# EAGLE schematic backplanev2-final (EAGLE 6.4)
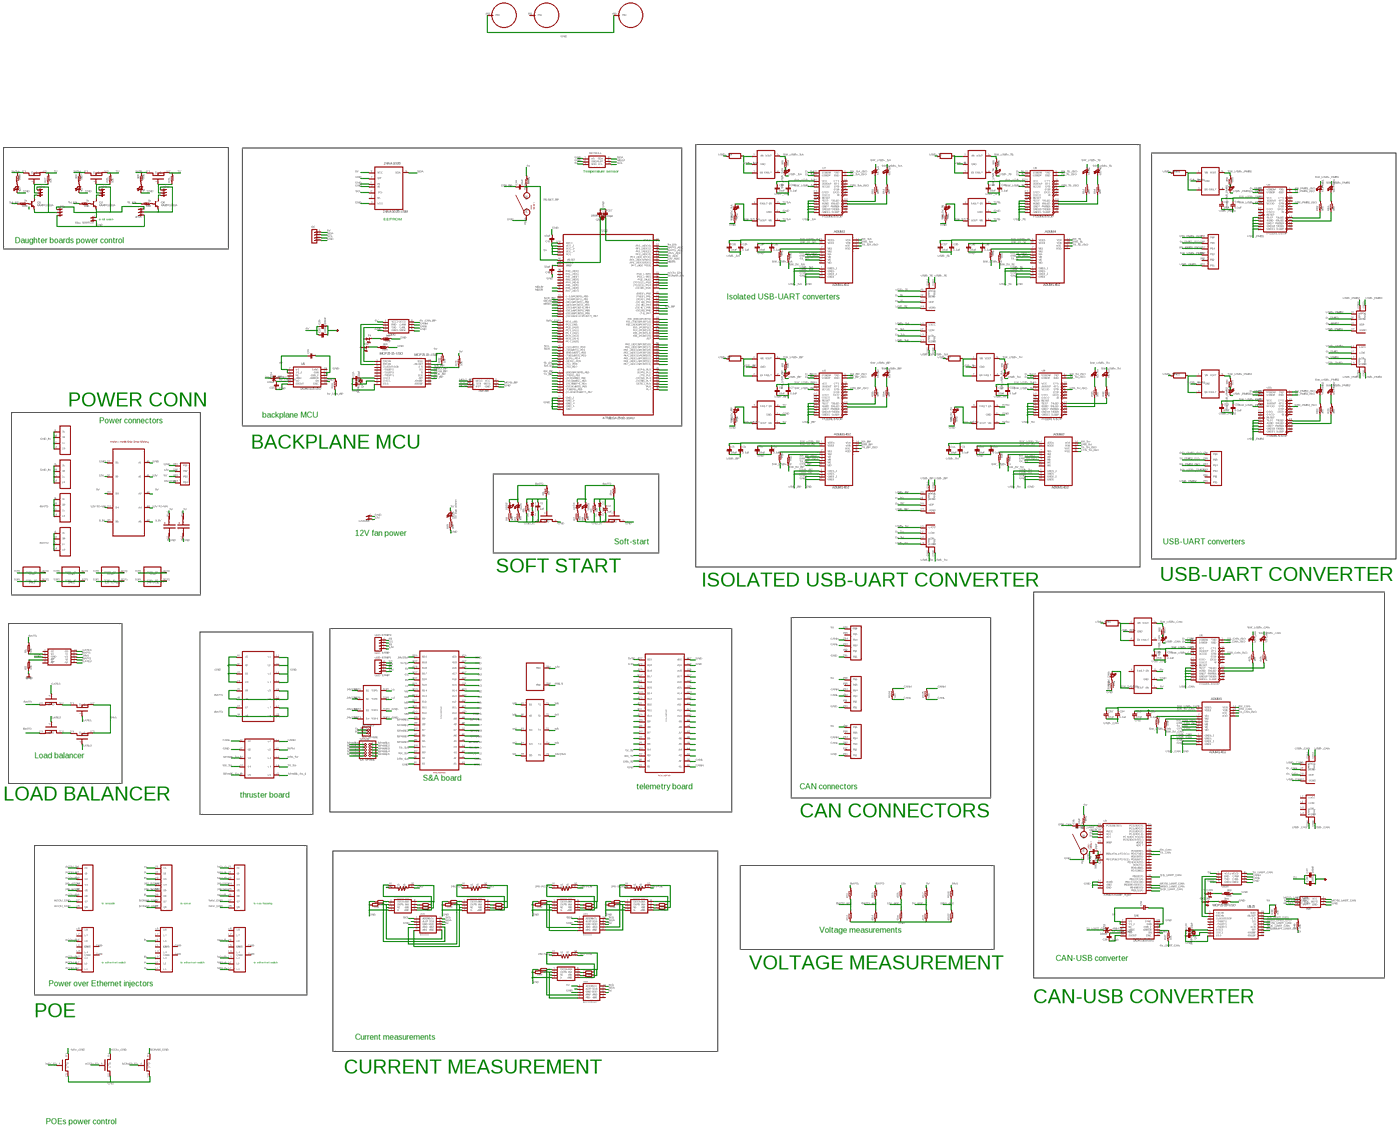
[diagram p0: schematic, sheet 1, overview]
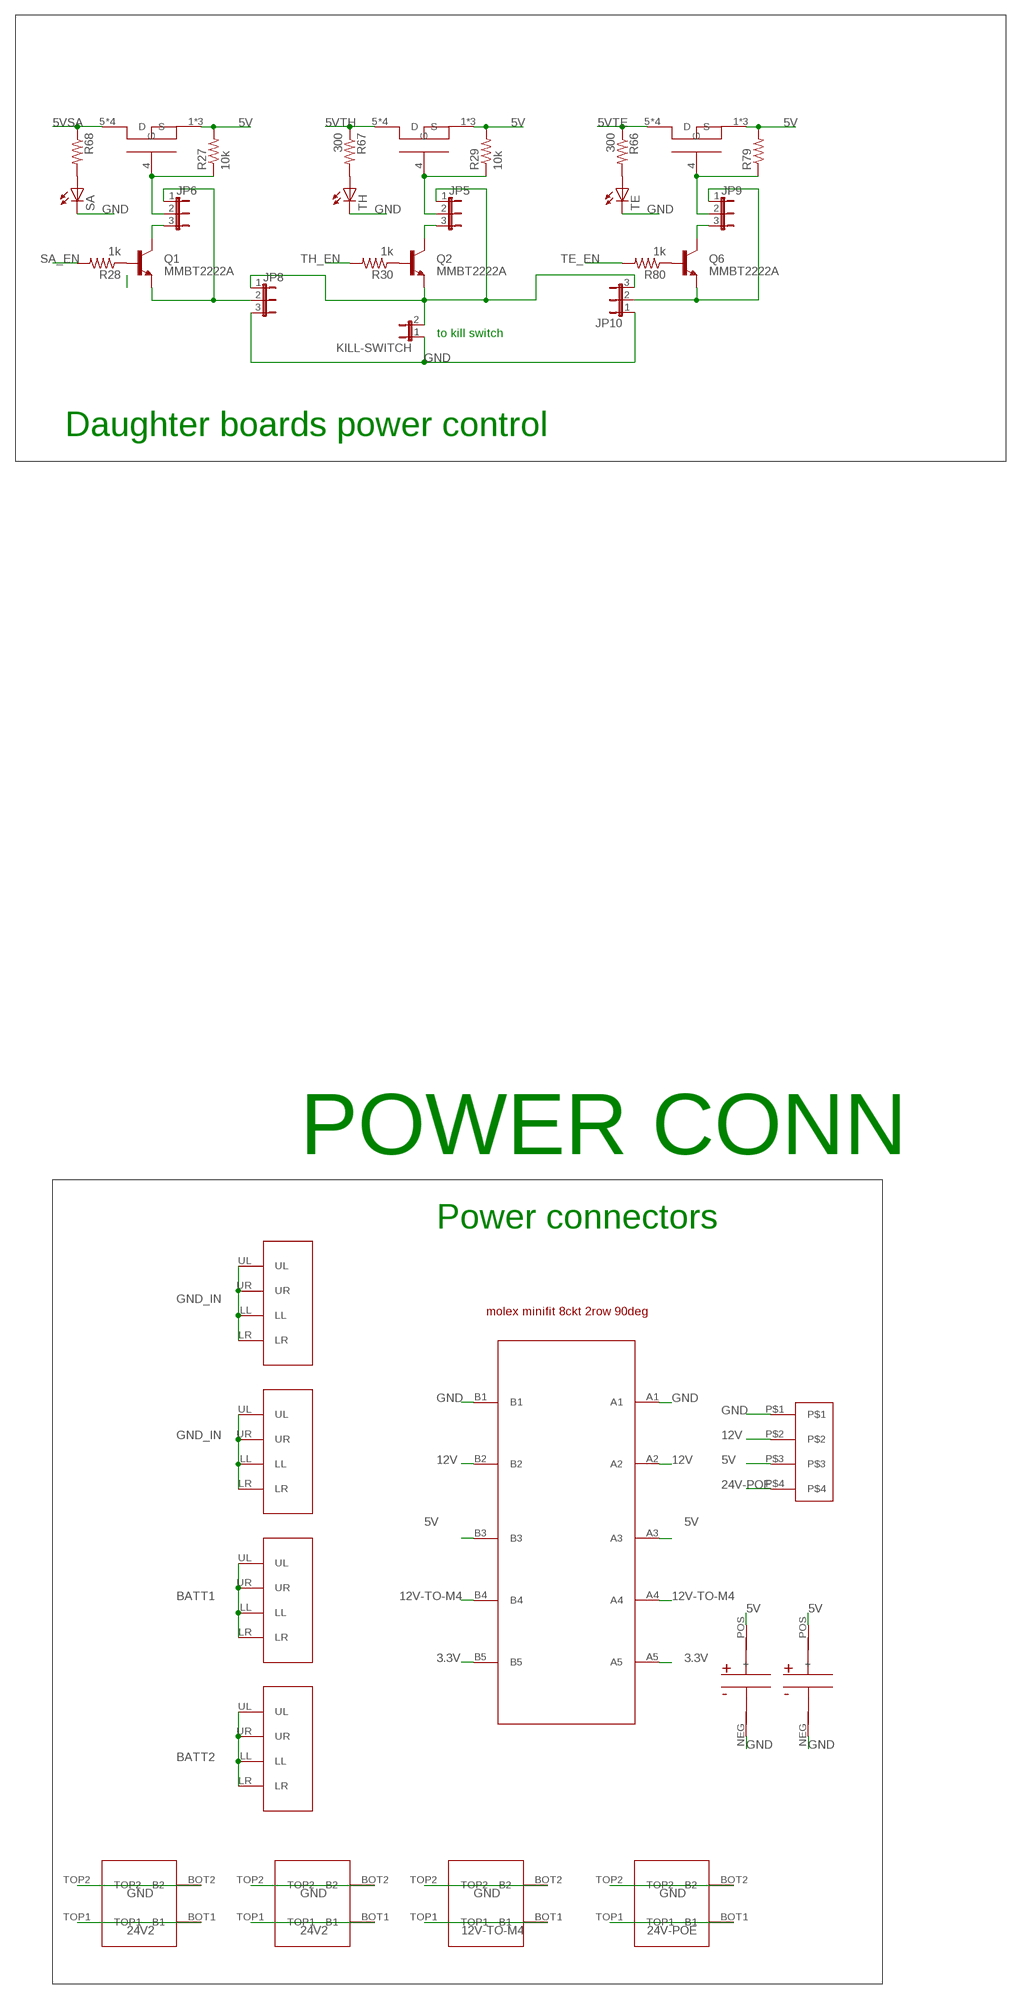
[diagram p1: schematic, sheet 1, part 1 of 9]
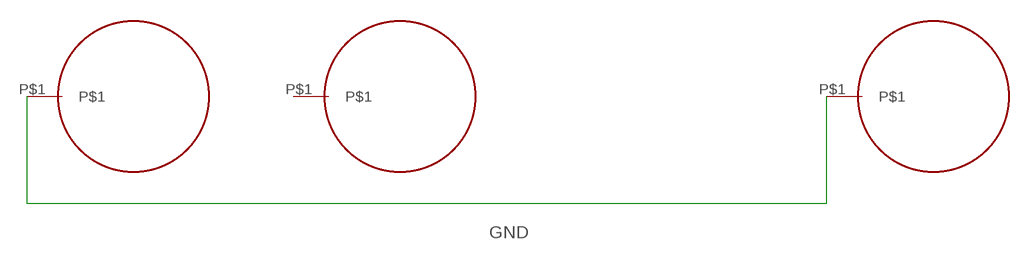
[diagram p2: schematic, sheet 1, part 2 of 9]
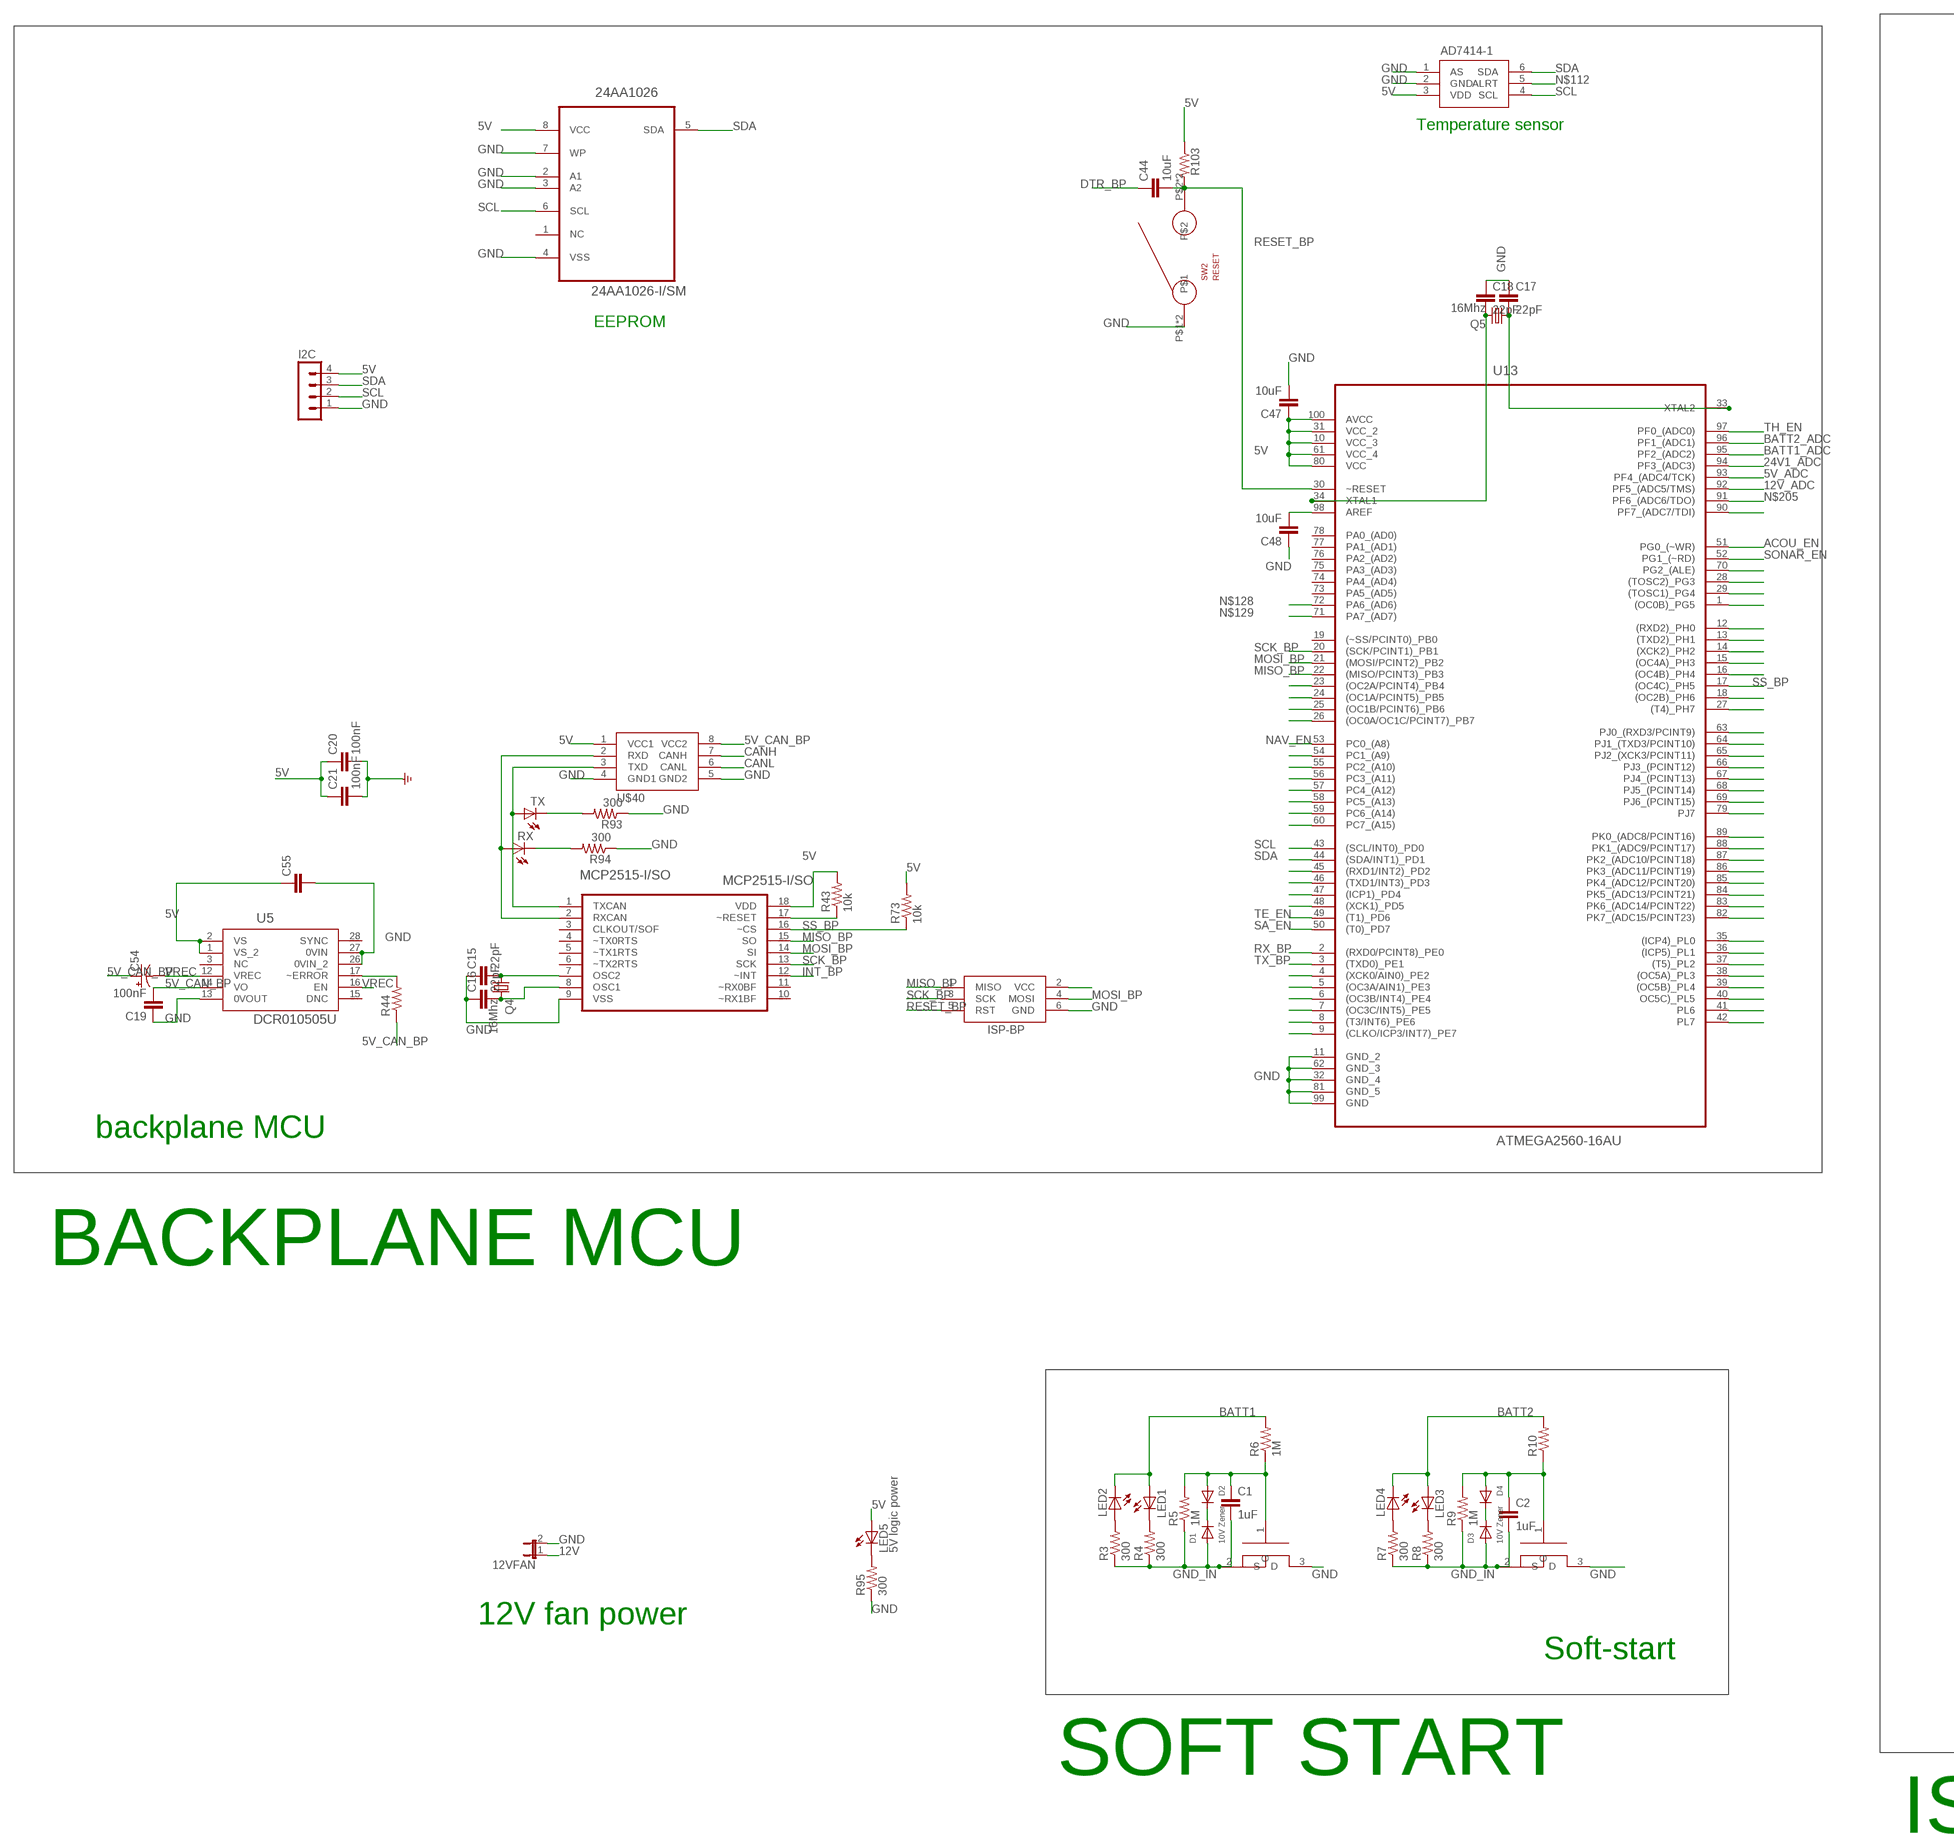
[diagram p3: schematic, sheet 1, part 3 of 9]
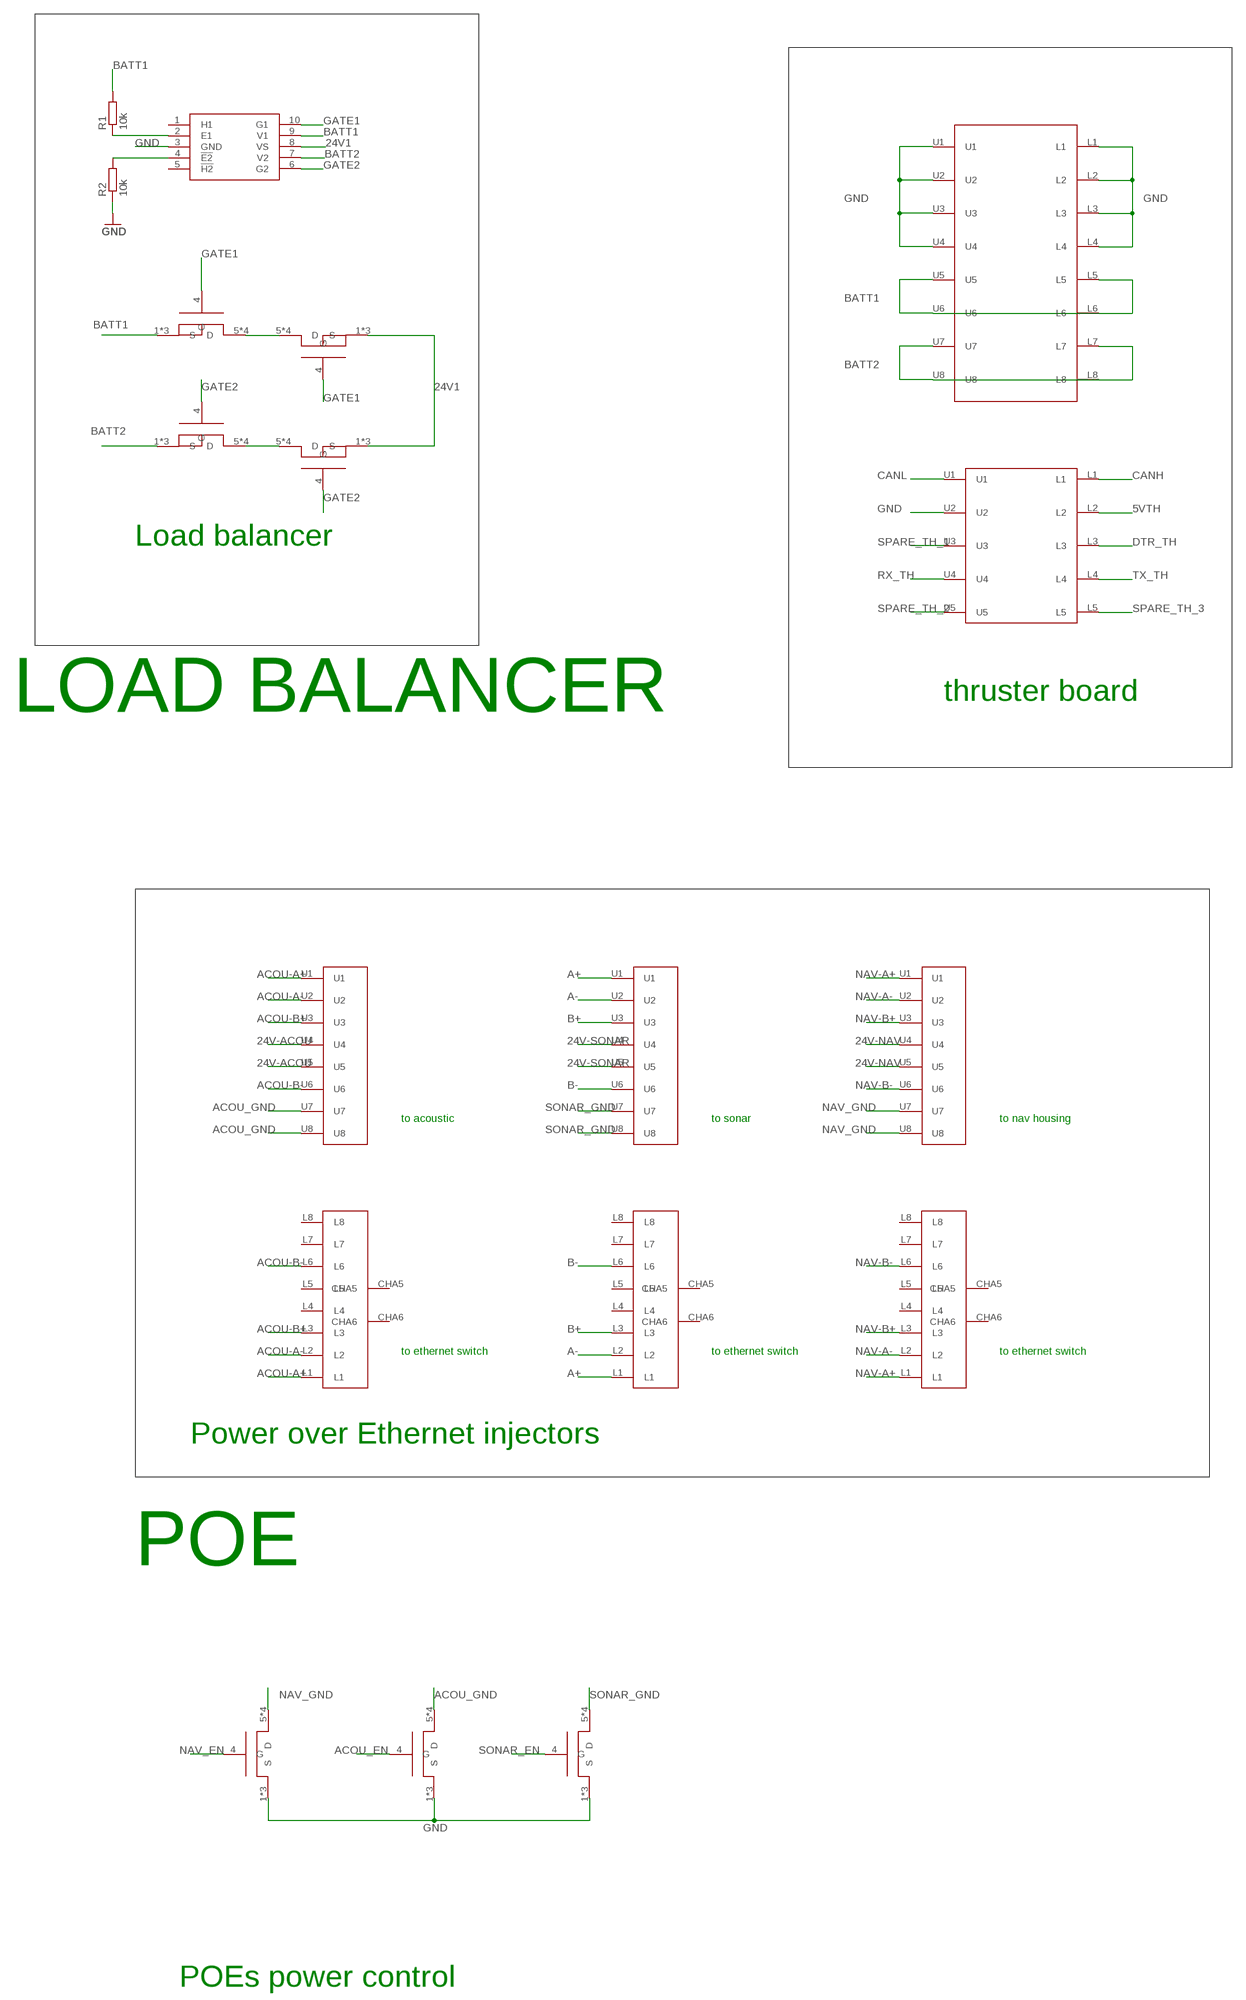
[diagram p4: schematic, sheet 1, part 4 of 9]
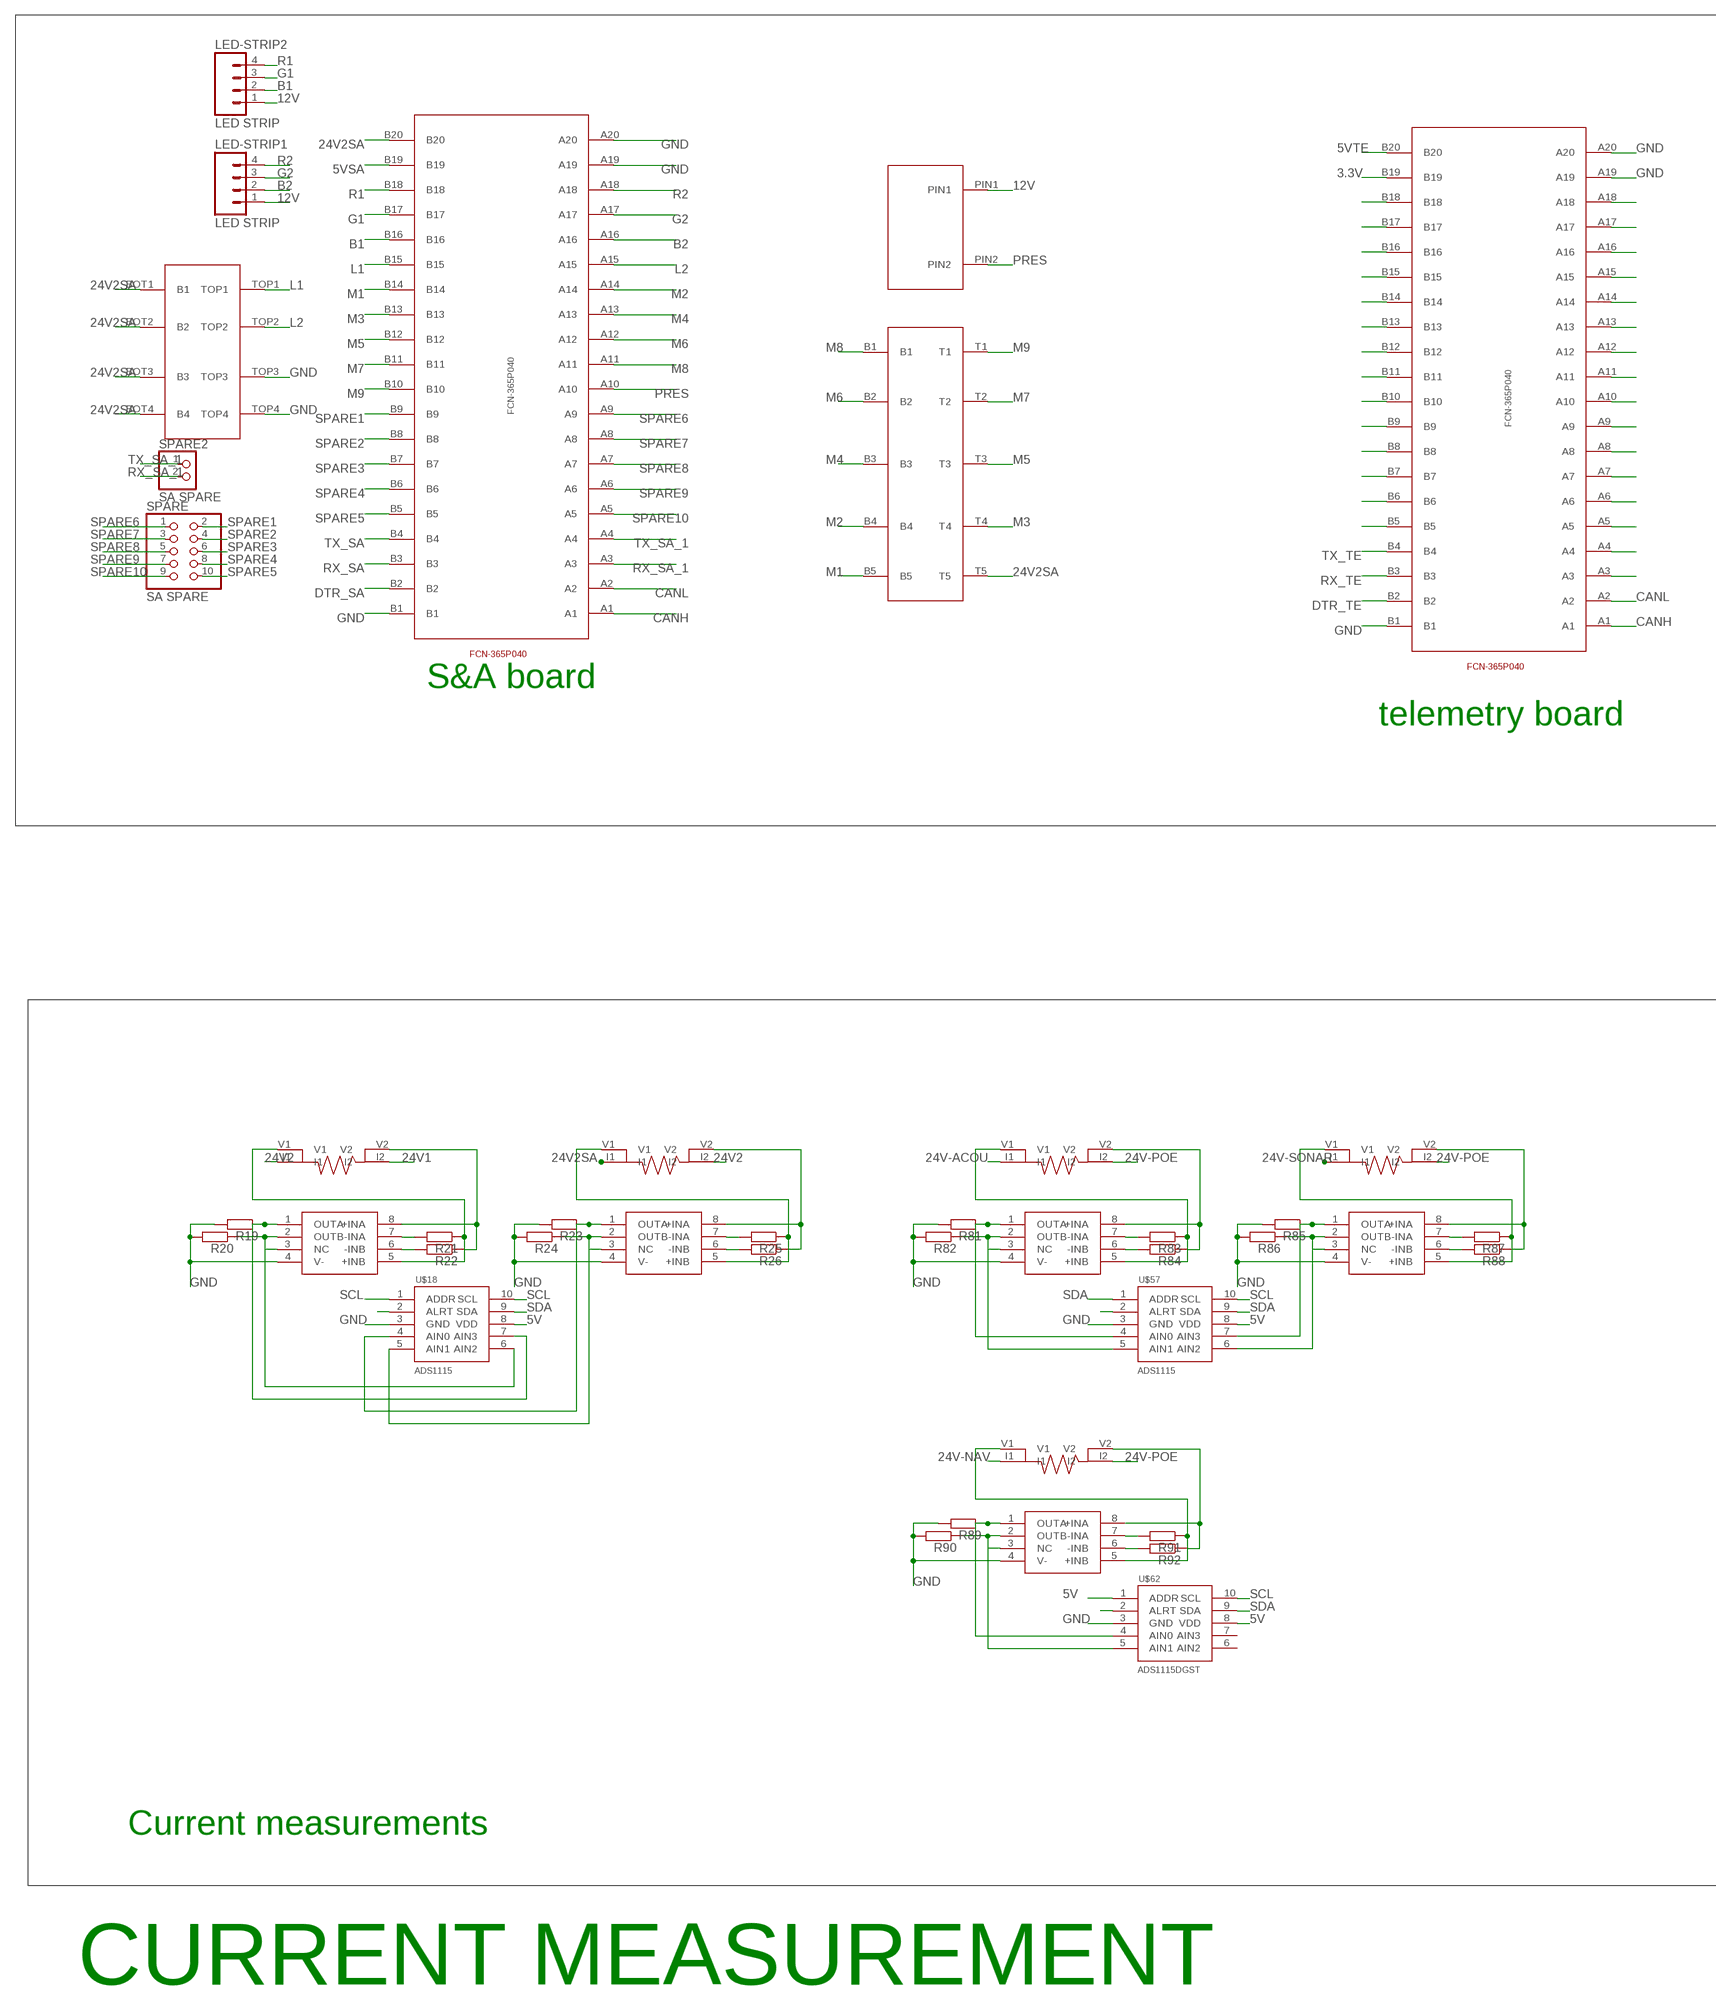
[diagram p5: schematic, sheet 1, part 5 of 9]
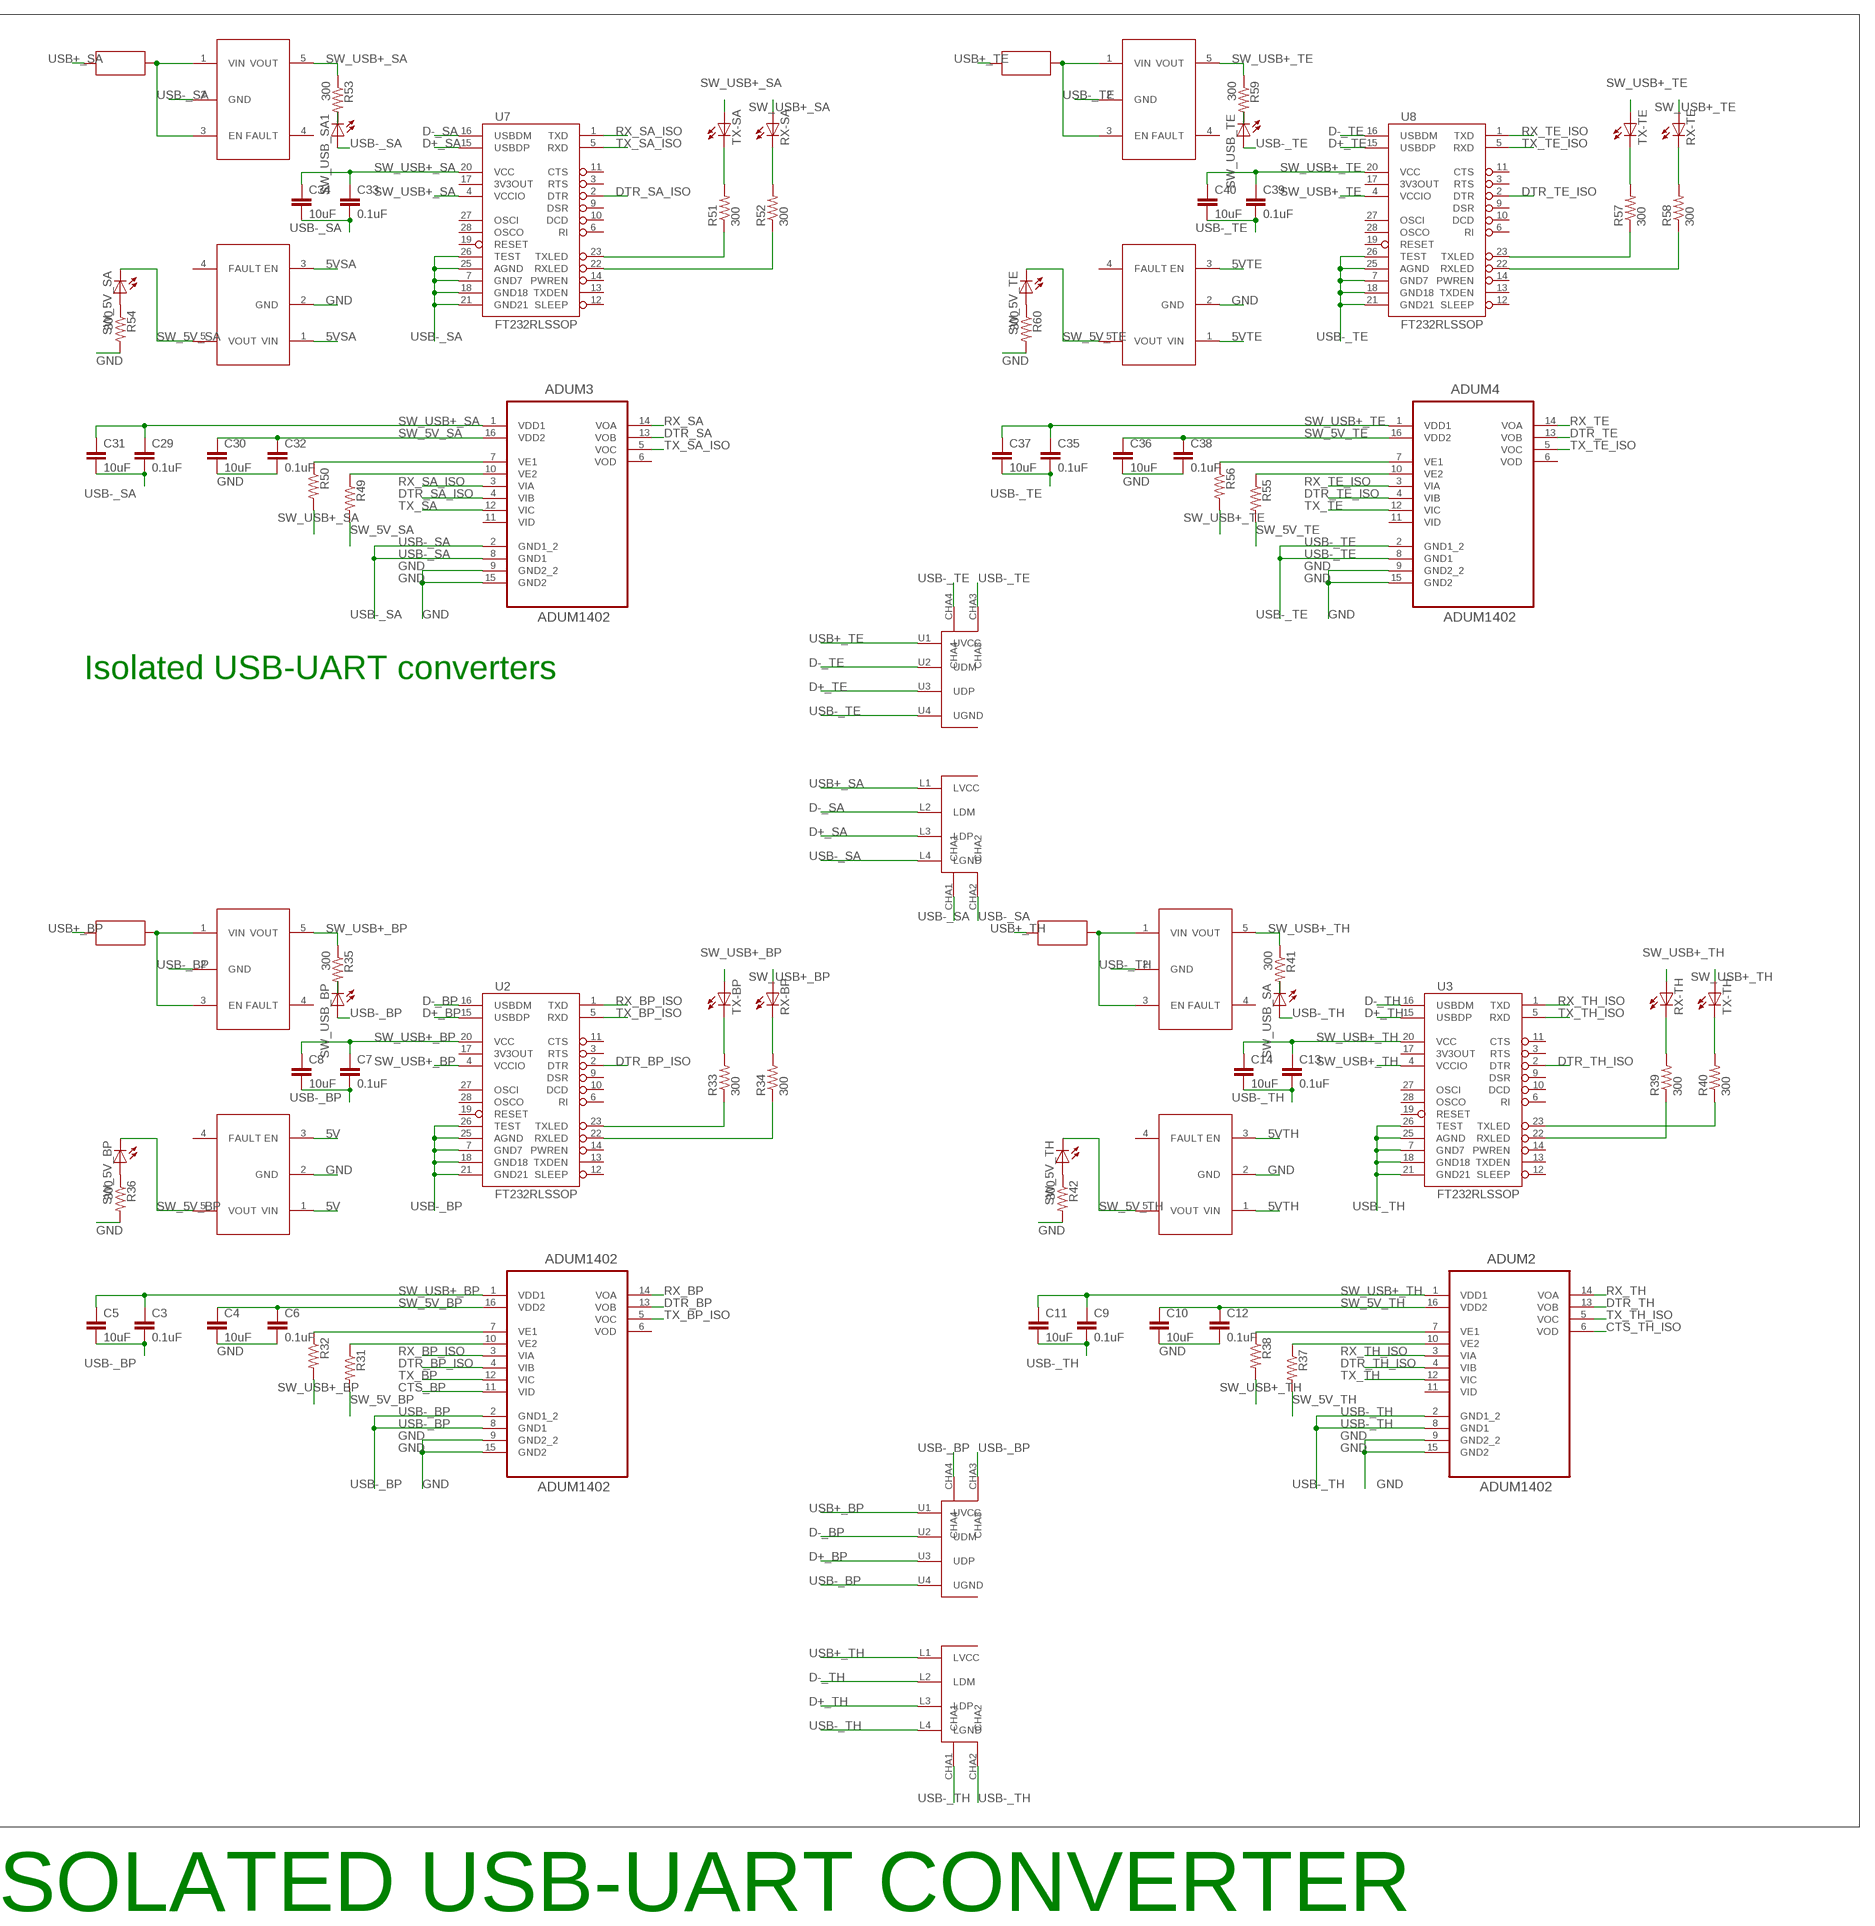
[diagram p6: schematic, sheet 1, part 6 of 9]
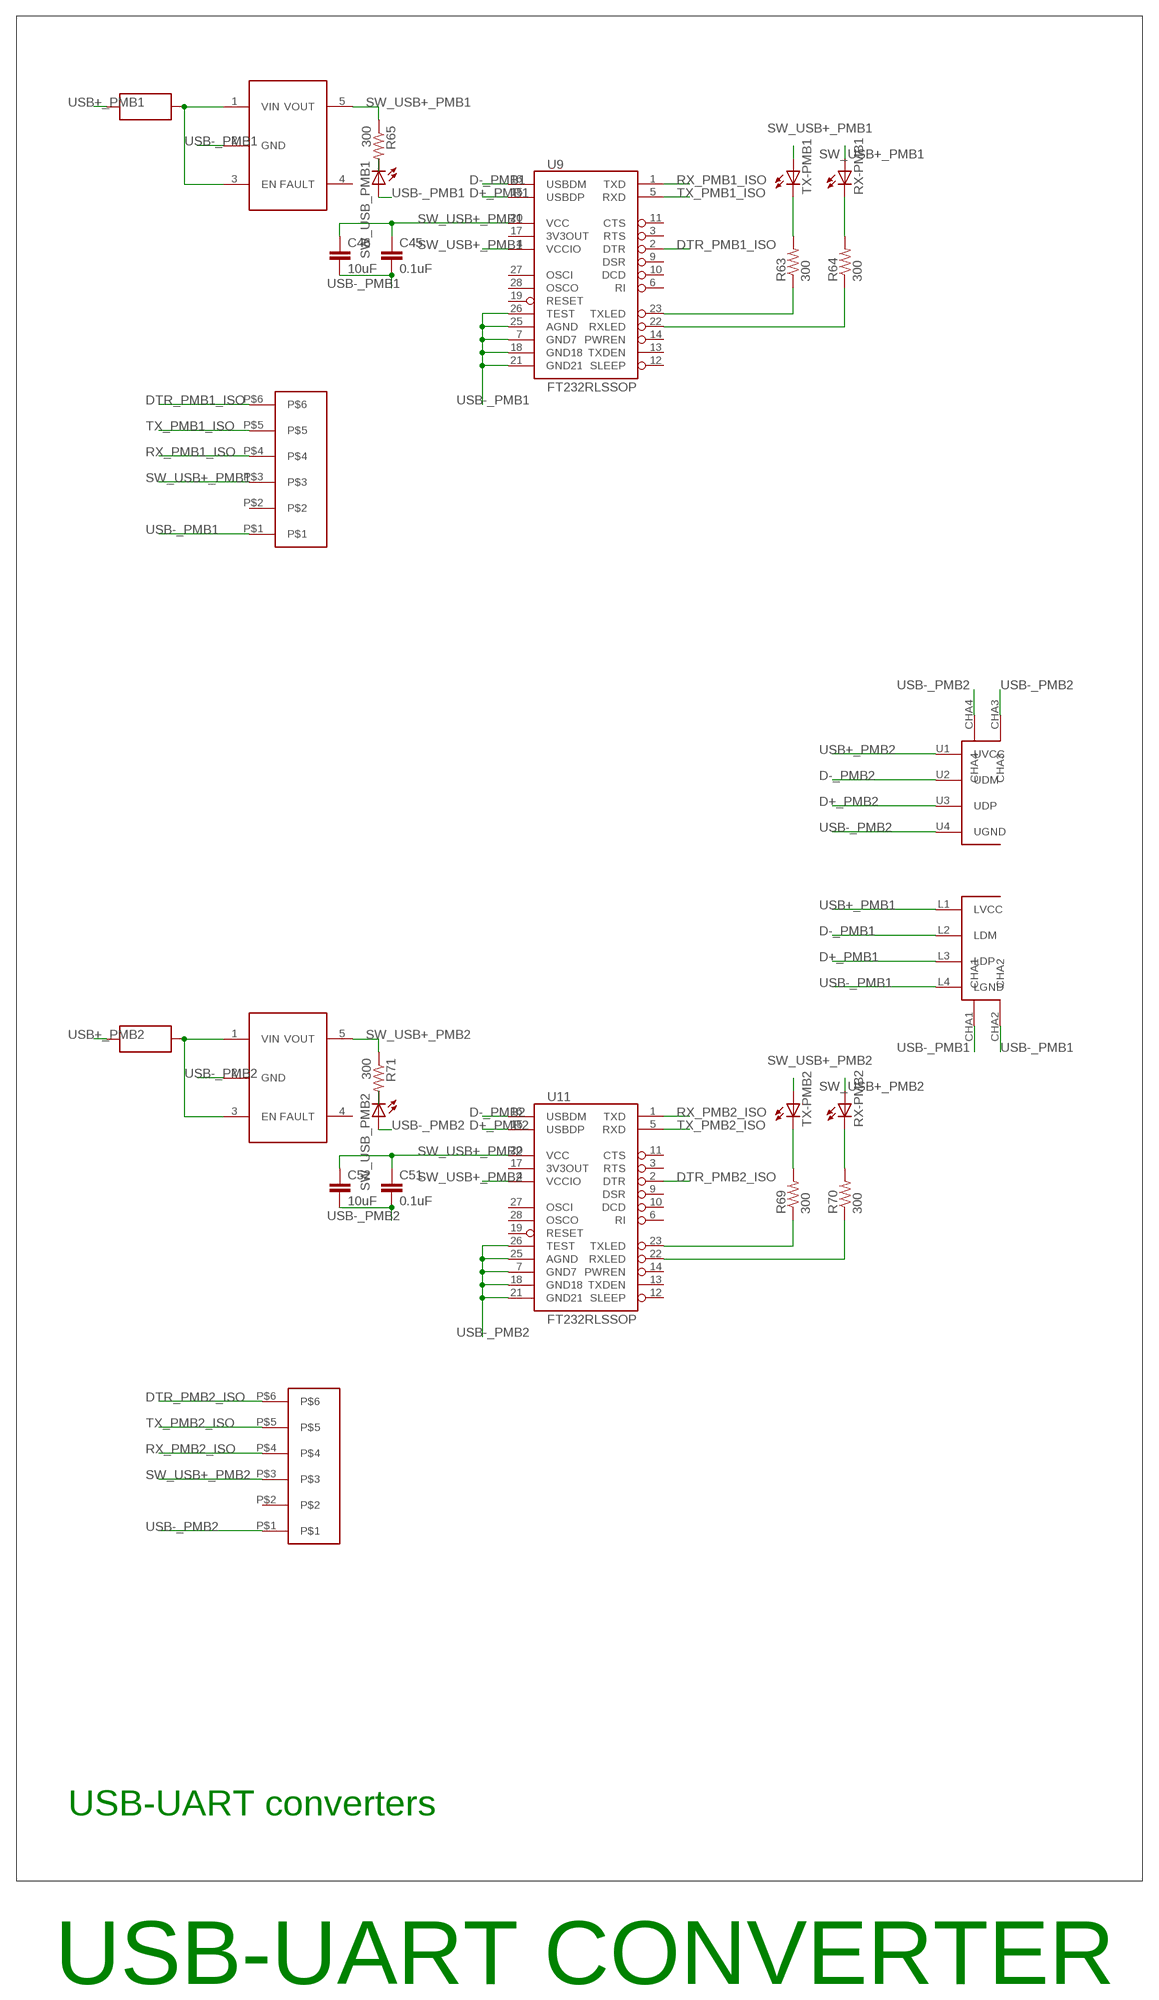
[diagram p7: schematic, sheet 1, part 7 of 9]
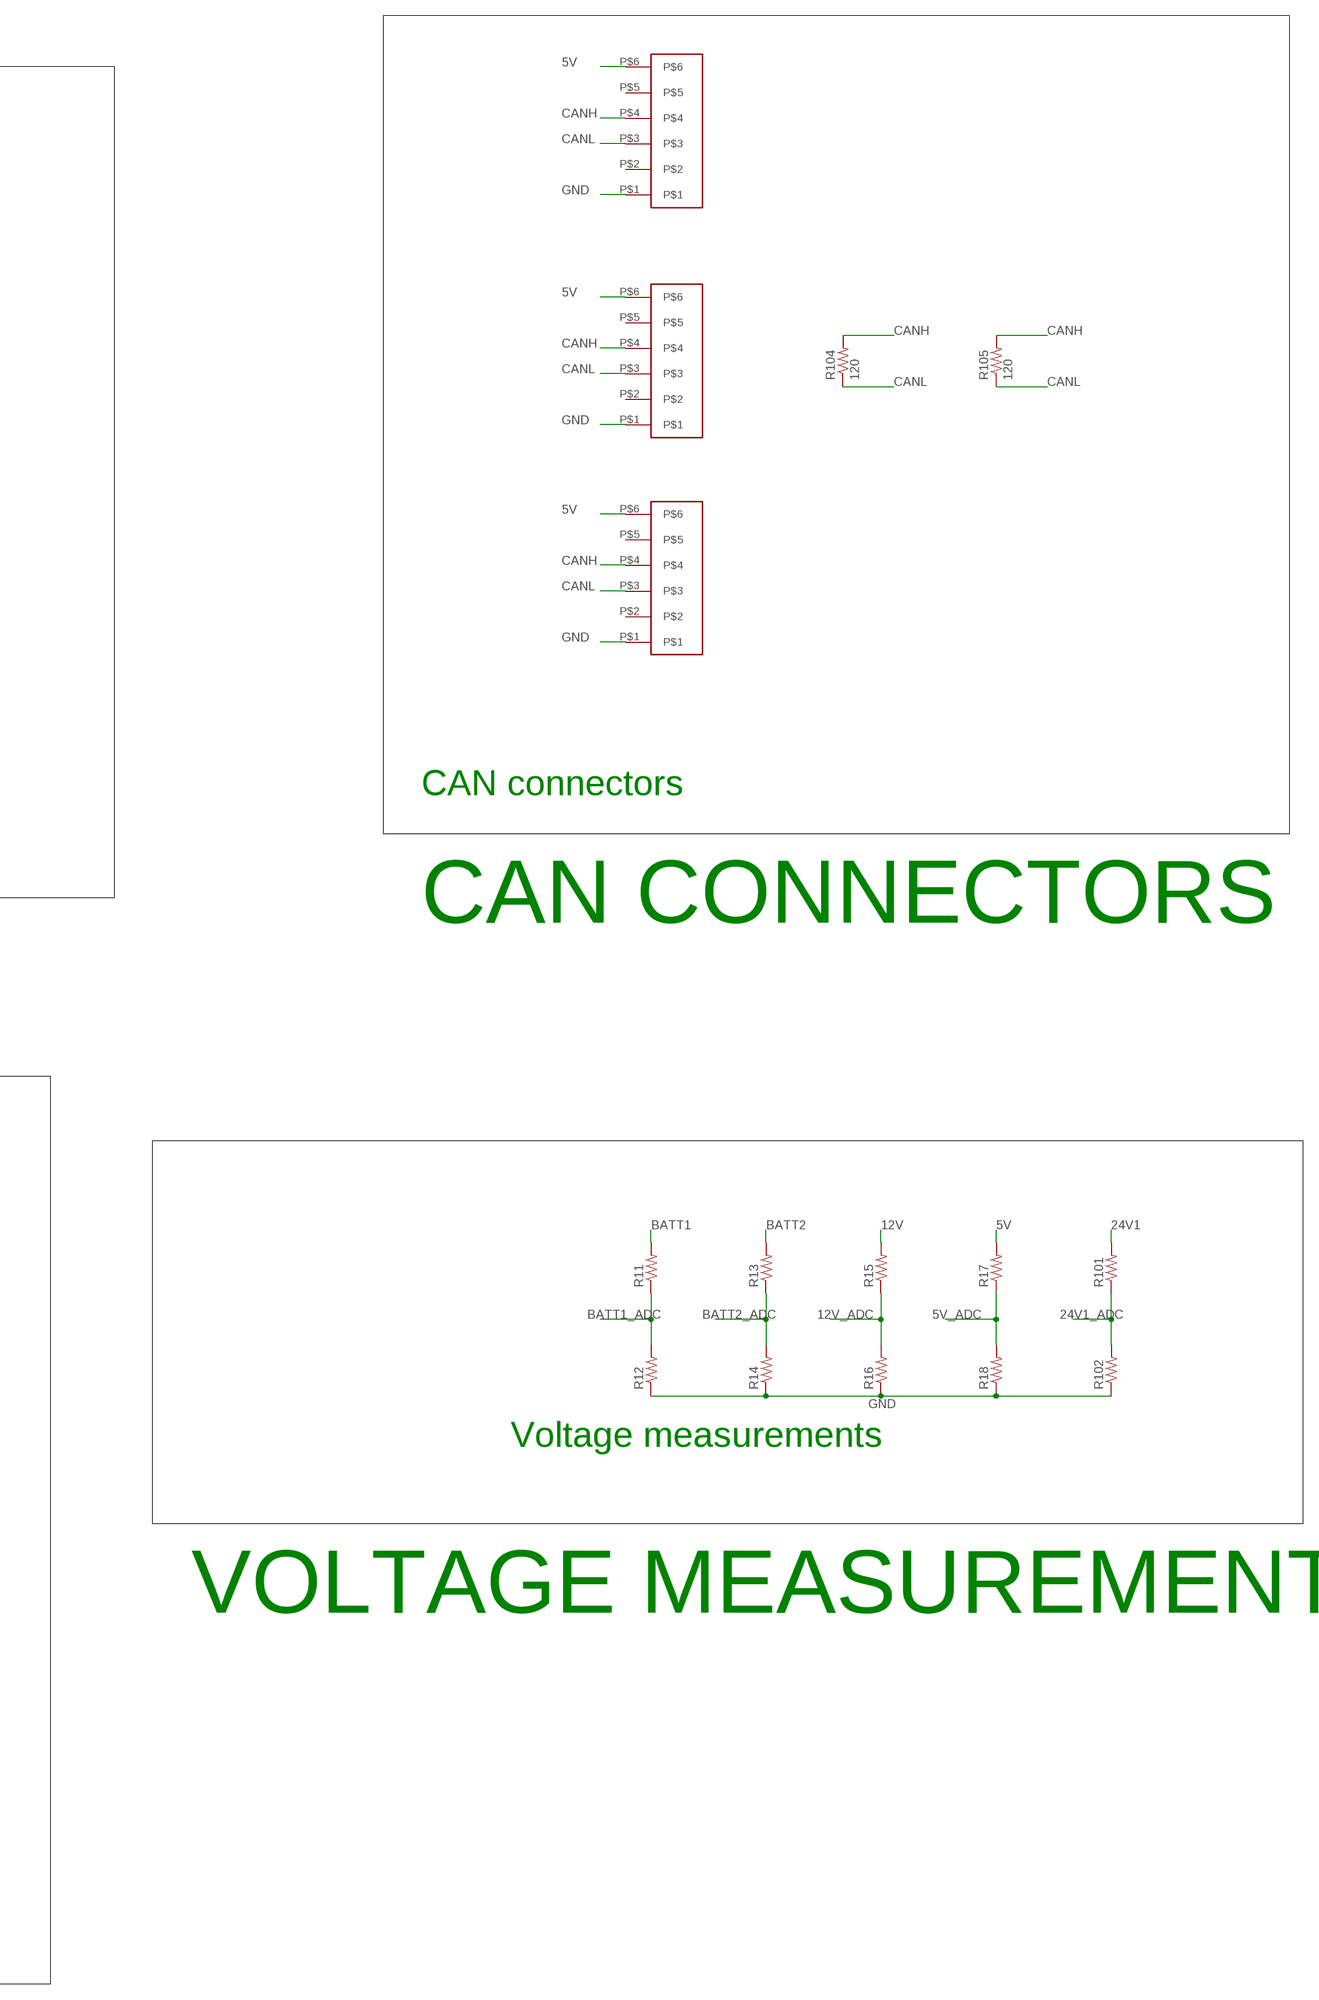
[diagram p8: schematic, sheet 1, part 8 of 9]
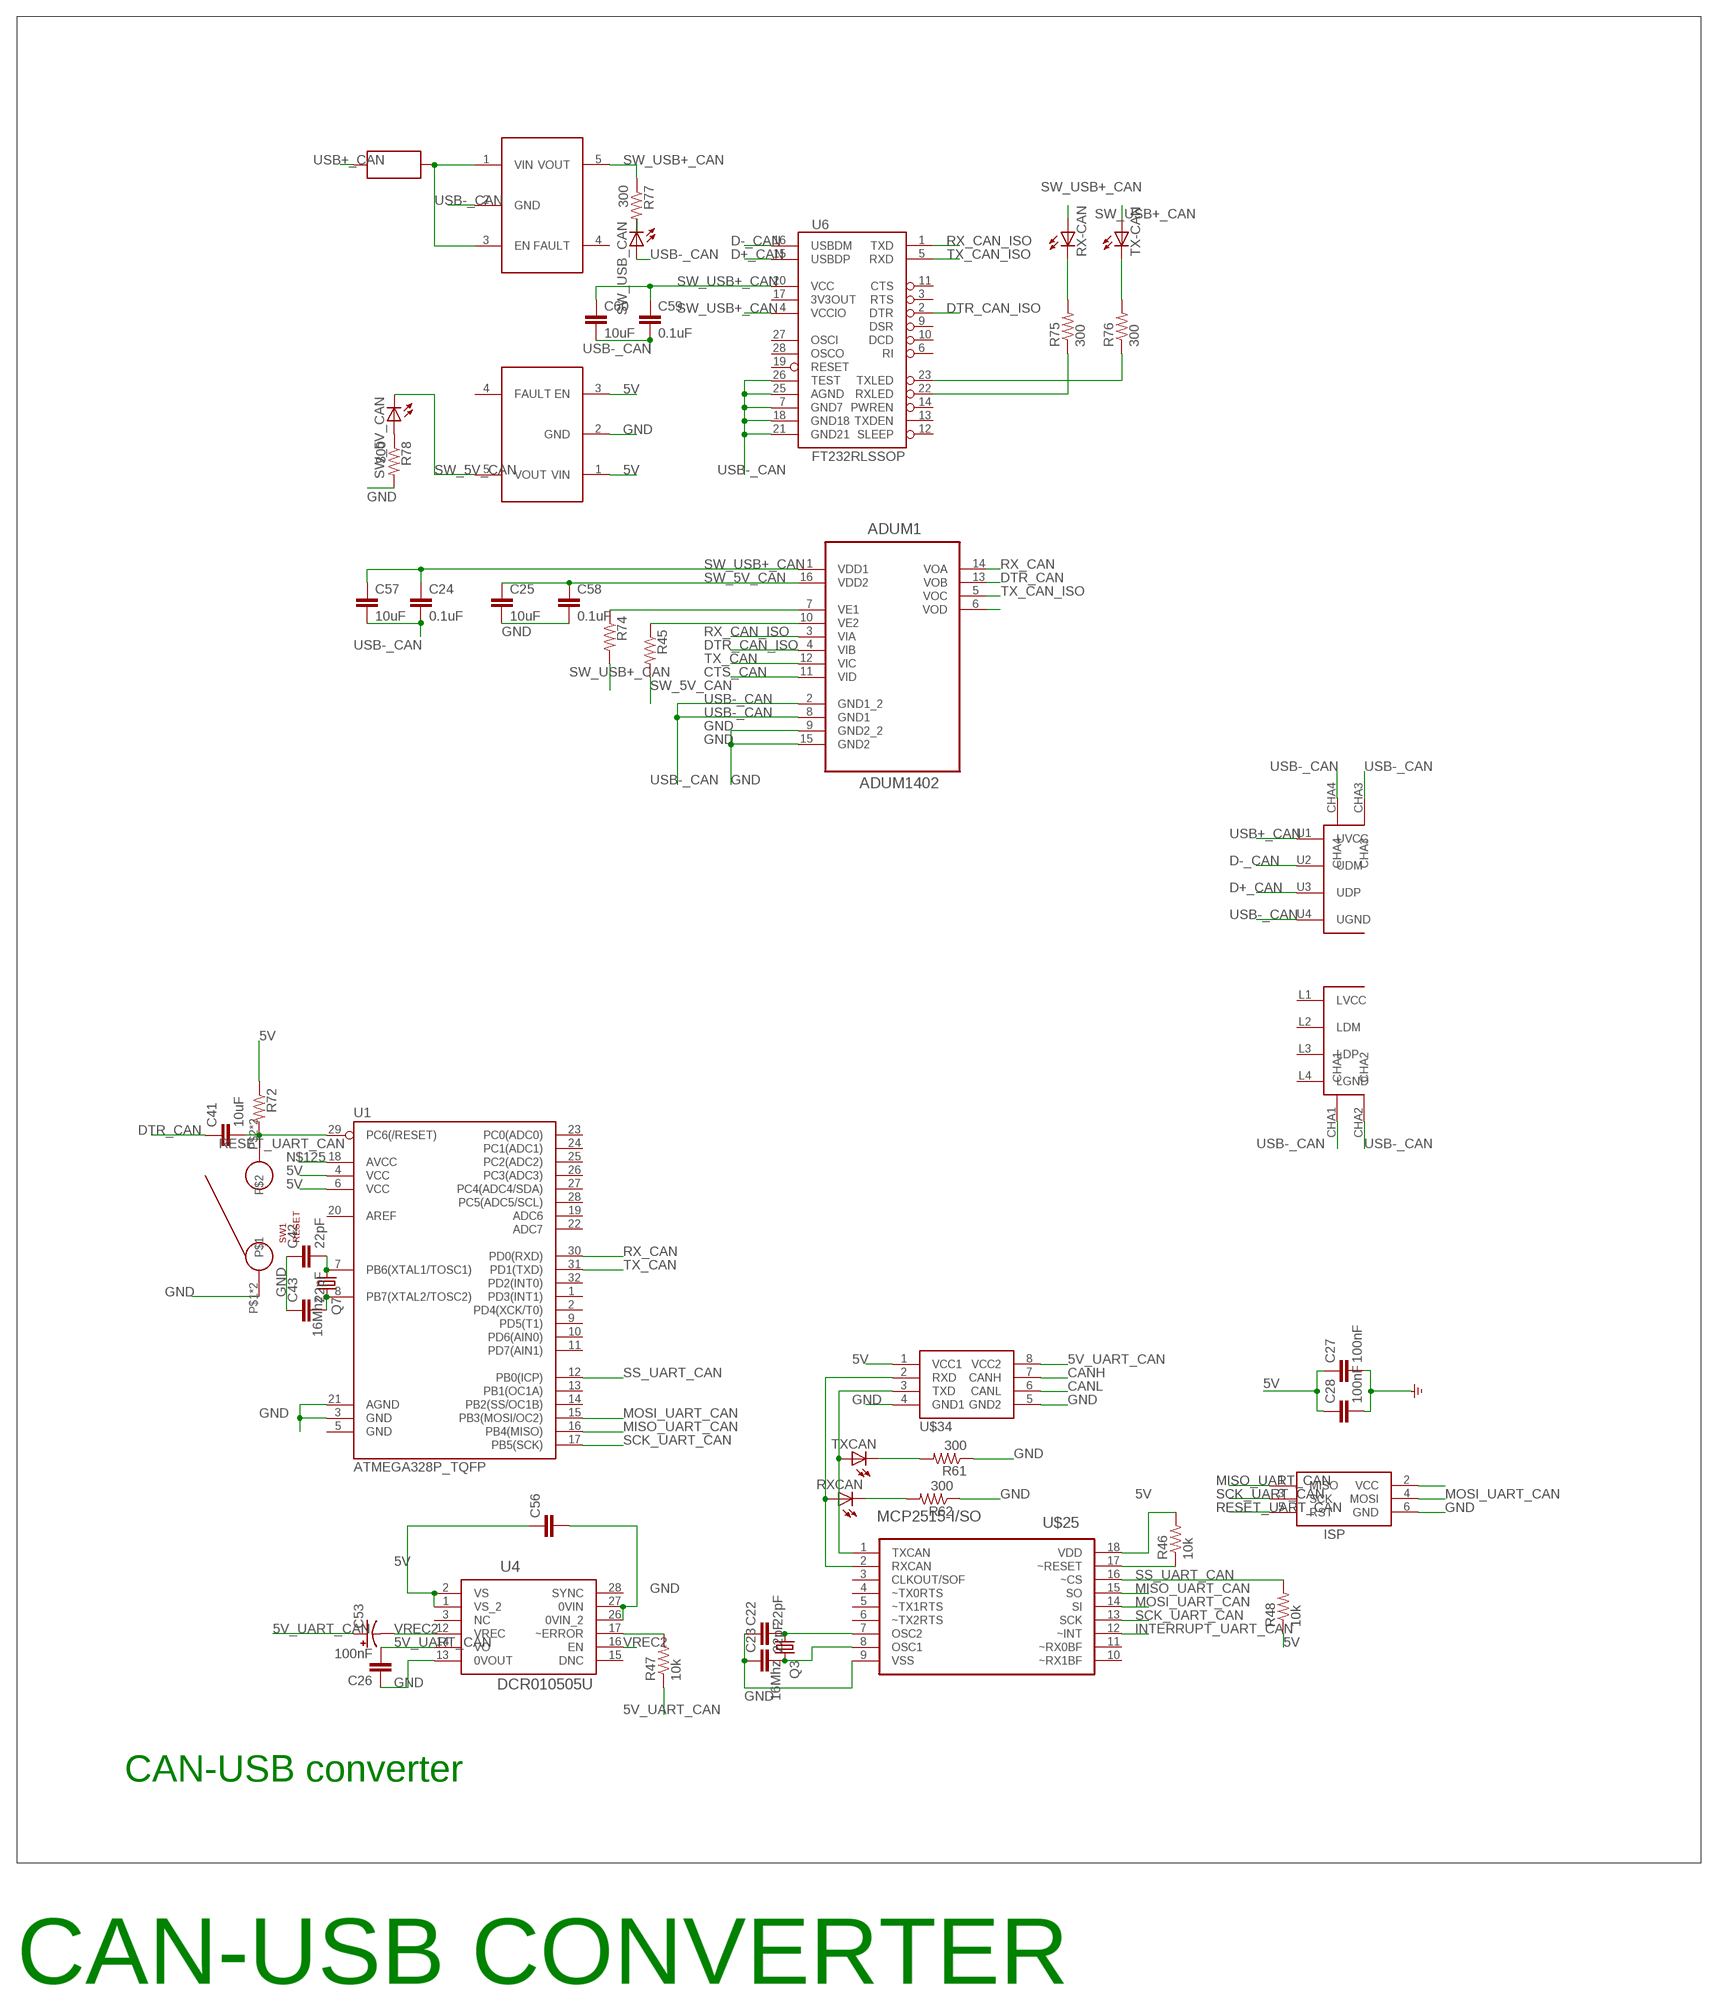
[diagram p9: schematic, sheet 1, part 9 of 9]

## Parts
12VFAN  JP1E  [JP1]
24AA1026  24AA1026-I/SM  [SOIC127P794X200-8N]
AD7414-1  AD7414-1  AD7414  [SOT23-6]
ADUM1  ADUM1402  ADUM1402ARWZ  [SOIC127P1032X265-16N]
ADUM2  ADUM1402  ADUM1402ARWZ  [SOIC127P1032X265-16N]
ADUM3  ADUM1402  ADUM1402ARWZ  [SOIC127P1032X265-16N]
ADUM4  ADUM1402  ADUM1402ARWZ  [SOIC127P1032X265-16N]
ADUM1402  ADUM1402  ADUM1402ARWZ  [SOIC127P1032X265-16N]
C1  1uF  CAP1206  [1206]
C2  1uF  CAP1206  [1206]
C3  0.1uF  CAP0805  [0805]
C4  10uF  CAP0805  [0805]
C5  10uF  CAP0805  [0805]
C6  0.1uF  CAP0805  [0805]
C7  0.1uF  CAP0805  [0805]
C8  10uF  CAP0805  [0805]
C9  0.1uF  CAP0805  [0805]
C10  10uF  CAP0805  [0805]
C11  10uF  CAP0805  [0805]
C12  0.1uF  CAP0805  [0805]
C13  0.1uF  CAP0805  [0805]
C14  10uF  CAP0805  [0805]
C15  22pF  CAP0805  [0805]
C16  22pF  CAP0805  [0805]
C17  22pF  CAP0805  [0805]
C18  22pF  CAP0805  [0805]
C19  100nF  CAP0805  [0805]
C20  100nF  1UF-25V-10%(0805)  [0805]
C21  100nF  1UF-25V-10%(0805)  [0805]
C22  22pF  CAP0805  [0805]
C23  22pF  CAP0805  [0805]
C24  0.1uF  CAP0805  [0805]
C25  10uF  CAP0805  [0805]
C26  100nF  CAP0805  [0805]
C27  100nF  1UF-25V-10%(0805)  [0805]
C28  100nF  1UF-25V-10%(0805)  [0805]
C29  0.1uF  CAP0805  [0805]
C30  10uF  CAP0805  [0805]
C31  10uF  CAP0805  [0805]
C32  0.1uF  CAP0805  [0805]
C33  0.1uF  CAP0805  [0805]
C34  10uF  CAP0805  [0805]
C35  0.1uF  CAP0805  [0805]
C36  10uF  CAP0805  [0805]
C37  10uF  CAP0805  [0805]
C38  0.1uF  CAP0805  [0805]
C39  0.1uF  CAP0805  [0805]
C40  10uF  CAP0805  [0805]
C41  10uF  CAP0805  [0805]
C42  22pF  CAP0805  [0805]
C43  22pF  CAP0805  [0805]
C44  10uF  CAP0805  [0805]
C45  0.1uF  CAP0805  [0805]
C46  10uF  CAP0805  [0805]
C47  10uF  CAP0805  [0805]
C48  10uF  CAP0805  [0805]
C51  0.1uF  CAP0805  [0805]
C52  10uF  CAP0805  [0805]
C53  CAP_POL6032  [EIA6032]
C54  CAP_POL6032  [EIA6032]
C55  CAP0603-CAP  [0603-CAP]
C56  CAP0603-CAP  [0603-CAP]
C57  10uF  CAP0805  [0805]
C58  0.1uF  CAP0805  [0805]
C59  0.1uF  CAP0805  [0805]
C60  10uF  CAP0805  [0805]
D1  10V Zener  DIODESOD-123  [SOD-123]
D2  DIODESOD-123  [SOD-123]
D3  10V Zener  DIODESOD-123  [SOD-123]
D4  DIODESOD-123  [SOD-123]
FERRITE  FERRITE-74279201  [RESC2013X65N]
FERRITE1  FERRITE-74279201  [RESC2013X65N]
FERRITE2  FERRITE-74279201  [RESC2013X65N]
FERRITE3  FERRITE-74279201  [RESC2013X65N]
FERRITE4  FERRITE-74279201  [RESC2013X65N]
FERRITE5  FERRITE-74279201  [RESC2013X65N]
FERRITE6  FERRITE-74279201  [RESC2013X65N]
I2C  MA04-1  [MA04-1]
ISP  AVRISP-6  [AVRISP]
ISP-BP  AVRISP-6  [AVRISP]
JP5  JP2E  [JP2]
JP6  JP2E  [JP2]
JP8  JP2E  [JP2]
JP9  JP2E  [JP2]
JP10  JP2E  [JP2]
KILL-SWITCH  JP1E  [JP1]
LED1  LEDSMT1206  [1206]
LED2  LEDSMT1206  [1206]
LED3  LEDSMT1206  [1206]
LED4  LEDSMT1206  [1206]
LED5  5V logic power  LEDSMT1206  [1206]
LED-STRIP1  LED STRIP  M04LOCK  [1X04_LOCK]
LED-STRIP2  LED STRIP  M04LOCK  [1X04_LOCK]
LTC4416  LTC4416  [MSOP10]
MCP2515-I/SO  MCP2515-I/SO  [SOIC127P1034X264-18N]
P-MOS  P-MOS  [SOIC8]
P-MOS1  P-MOS  [SOIC8]
P-MOS2  P-MOS  [SOIC8]
P-MOS3  P-MOS  [SOIC8]
P-MOS4  P-MOS  [SOIC8]
P-MOS5  P-MOS  [SOIC8]
P-MOS6  P-MOS  [SOIC8]
Q1  MMBT2222A  TRANSISTOR_NPNMMBT2222A  [SOT23-3]
Q2  MMBT2222A  TRANSISTOR_NPNMMBT2222A  [SOT23-3]
Q3  16Mhz  CRYSTALSM49  [SM49]
Q4  16Mhz  CRYSTALSM49  [SM49]
Q5  16Mhz  CRYSTALSM49  [SM49]
Q6  MMBT2222A  TRANSISTOR_NPNMMBT2222A  [SOT23-3]
Q7  16Mhz  CRYSTALSM49  [SM49]
R1  10k  R-EU_M0805  [M0805]
R2  10k  R-EU_M0805  [M0805]
R3  300  RESISTOR0805-RES  [0805]
R4  300  RESISTOR0805-RES  [0805]
R5  1M  RESISTOR0805-RES  [0805]
R6  1M  RESISTOR0805-RES  [0805]
R7  300  RESISTOR0805-RES  [0805]
R8  300  RESISTOR0805-RES  [0805]
R9  1M  RESISTOR0805-RES  [0805]
R10  RESISTOR0805-RES  [0805]
R11  RESISTOR0805-RES  [0805]
R12  RESISTOR0805-RES  [0805]
R13  RESISTOR0805-RES  [0805]
R14  RESISTOR0805-RES  [0805]
R15  RESISTOR0805-RES  [0805]
R16  RESISTOR0805-RES  [0805]
R17  RESISTOR0805-RES  [0805]
R18  RESISTOR0805-RES  [0805]
R19  R-EU_M0805  [M0805]
R20  R-EU_M0805  [M0805]
R21  R-EU_M0805  [M0805]
R22  R-EU_M0805  [M0805]
R23  R-EU_M0805  [M0805]
R24  R-EU_M0805  [M0805]
R25  R-EU_M0805  [M0805]
R26  R-EU_M0805  [M0805]
R27  10k  RESISTOR0805-RES  [0805]
R28  1k  RESISTOR0805-RES  [0805]
R29  10k  RESISTOR0805-RES  [0805]
R30  1k  RESISTOR0805-RES  [0805]
R31  RESISTOR0805-RES  [0805]
R32  RESISTOR0805-RES  [0805]
R33  300  RESISTOR0805-RES  [0805]
R34  300  RESISTOR0805-RES  [0805]
R35  300  RESISTOR0805-RES  [0805]
R36  300  RESISTOR0805-RES  [0805]
R37  RESISTOR0805-RES  [0805]
R38  RESISTOR0805-RES  [0805]
R39  300  RESISTOR0805-RES  [0805]
R40  300  RESISTOR0805-RES  [0805]
R41  300  RESISTOR0805-RES  [0805]
R42  300  RESISTOR0805-RES  [0805]
R43  10k  RESISTOR0805-RES  [0805]
R44  RESISTOR0805-RES  [0805]
R45  RESISTOR0805-RES  [0805]
R46  10k  RESISTOR0805-RES  [0805]
R47  10k  RESISTOR0805-RES  [0805]
R48  10k  RESISTOR0805-RES  [0805]
R49  RESISTOR0805-RES  [0805]
R50  RESISTOR0805-RES  [0805]
R51  300  RESISTOR0805-RES  [0805]
R52  300  RESISTOR0805-RES  [0805]
R53  300  RESISTOR0805-RES  [0805]
R54  300  RESISTOR0805-RES  [0805]
R55  RESISTOR0805-RES  [0805]
R56  RESISTOR0805-RES  [0805]
R57  300  RESISTOR0805-RES  [0805]
R58  300  RESISTOR0805-RES  [0805]
R59  300  RESISTOR0805-RES  [0805]
R60  300  RESISTOR0805-RES  [0805]
R61  300  RESISTOR0805-RES  [0805]
R62  300  RESISTOR0805-RES  [0805]
R63  300  RESISTOR0805-RES  [0805]
R64  300  RESISTOR0805-RES  [0805]
R65  300  RESISTOR0805-RES  [0805]
R66  300  RESISTOR0805-RES  [0805]
R67  300  RESISTOR0805-RES  [0805]
R68  RESISTOR0805-RES  [0805]
R69  300  RESISTOR0805-RES  [0805]
R70  300  RESISTOR0805-RES  [0805]
R71  300  RESISTOR0805-RES  [0805]
R72  RESISTOR0805-RES  [0805]
R73  10k  RESISTOR0805-RES  [0805]
R74  RESISTOR0805-RES  [0805]
R75  300  RESISTOR0805-RES  [0805]
R76  300  RESISTOR0805-RES  [0805]
R77  300  RESISTOR0805-RES  [0805]
R78  300  RESISTOR0805-RES  [0805]
R79  RESISTOR0805-RES  [0805]
R80  1k  RESISTOR0805-RES  [0805]
R81  R-EU_M0805  [M0805]
R82  R-EU_M0805  [M0805]
R83  R-EU_M0805  [M0805]
R84  R-EU_M0805  [M0805]
R85  R-EU_M0805  [M0805]
R86  R-EU_M0805  [M0805]
R87  R-EU_M0805  [M0805]
R88  R-EU_M0805  [M0805]
R89  R-EU_M0805  [M0805]
R90  R-EU_M0805  [M0805]
R91  R-EU_M0805  [M0805]
R92  R-EU_M0805  [M0805]
R93  300  RESISTOR0805-RES  [0805]
R94  300  RESISTOR0805-RES  [0805]
R95  300  RESISTOR0805-RES  [0805]
R101  RESISTOR0805-RES  [0805]
R102  RESISTOR0805-RES  [0805]
R103  RESISTOR0805-RES  [0805]
R104  120  RESISTOR0805-RES  [0805]
R105  120  RESISTOR0805-RES  [0805]
RX  LEDCHIPLED_0805  [CHIPLED_0805]
RX-BP  LEDCHIPLED_0805  [CHIPLED_0805]
RX-CAN  LEDCHIPLED_0805  [CHIPLED_0805]
RX-PMB1  LEDCHIPLED_0805  [CHIPLED_0805]
RX-PMB2  LEDCHIPLED_0805  [CHIPLED_0805]
RX-SA  LEDCHIPLED_0805  [CHIPLED_0805]
RX-TE  LEDCHIPLED_0805  [CHIPLED_0805]
RX-TH  LEDCHIPLED_0805  [CHIPLED_0805]
RXCAN  LEDCHIPLED_0805  [CHIPLED_0805]
SA  LEDCHIPLED_0805  [CHIPLED_0805]
SPARE  SA SPARE  PINHD-2X5  [2X05]
SPARE2  SA SPARE  PINHD-1X2  [1X02]
SW1  RESET  MC32829  [MC32829]
SW2  RESET  MC32829  [MC32829]
SW_5V_BP  LEDCHIPLED_0805  [CHIPLED_0805]
SW_5V_CAN  LEDCHIPLED_0805  [CHIPLED_0805]
SW_5V_SA  LEDCHIPLED_0805  [CHIPLED_0805]
SW_5V_TE  LEDCHIPLED_0805  [CHIPLED_0805]
SW_5V_TH  LEDCHIPLED_0805  [CHIPLED_0805]
SW_USB_BP  LEDCHIPLED_0805  [CHIPLED_0805]
SW_USB_CAN  LEDCHIPLED_0805  [CHIPLED_0805]
SW_USB_PMB1  LEDCHIPLED_0805  [CHIPLED_0805]
SW_USB_PMB2  LEDCHIPLED_0805  [CHIPLED_0805]
SW_USB_SA  LEDCHIPLED_0805  [CHIPLED_0805]
SW_USB_SA1  LEDCHIPLED_0805  [CHIPLED_0805]
SW_USB_TE  LEDCHIPLED_0805  [CHIPLED_0805]
TE  LEDCHIPLED_0805  [CHIPLED_0805]
TH  LEDCHIPLED_0805  [CHIPLED_0805]
TX  LEDCHIPLED_0805  [CHIPLED_0805]
TX-BP  LEDCHIPLED_0805  [CHIPLED_0805]
TX-CAN  LEDCHIPLED_0805  [CHIPLED_0805]
TX-PMB1  LEDCHIPLED_0805  [CHIPLED_0805]
TX-PMB2  LEDCHIPLED_0805  [CHIPLED_0805]
TX-SA  LEDCHIPLED_0805  [CHIPLED_0805]
TX-TE  LEDCHIPLED_0805  [CHIPLED_0805]
TX-TH  LEDCHIPLED_0805  [CHIPLED_0805]
TXCAN  LEDCHIPLED_0805  [CHIPLED_0805]
U1  ATMEGA328P_TQFP  [TQFP32-08]
U2  FT232RLSSOP  [SSOP28DB]
U3  FT232RLSSOP  [SSOP28DB]
U4  DCR010505U  [SOIC127P1032X265-12NA]
U5  DCR010505U  [SOIC127P1032X265-12NA]
U6  FT232RLSSOP  [SSOP28DB]
U7  FT232RLSSOP  [SSOP28DB]
U8  FT232RLSSOP  [SSOP28DB]
U9  FT232RLSSOP  [SSOP28DB]
U11  FT232RLSSOP  [SSOP28DB]
U13  ATMEGA2560-16AU  [QFP50P1600X1600X120-100N]
U$1  TERM-BLOCK-4POS  [TERM-BLOCK-4POS]
U$2  PLATED-HOLE  [PLATED-HOLE]
U$3  RJ45-DUAL-SOCKET  [RJ45DOUBLESOCKET]
U$4  MINIFIT-16CKT-STRAIGHTHEADER  [MINIFIT-16CKT-STRAIGHTHEADER]
U$5  100UF  100UF-AFK-CAP  [100UF-AFK-CAP]
U$6  LTC6103  [MSOP8]
U$7  IRLR3636PBF(N-MOS)  [TO252]
U$8  S6B-XH-SM4-TB(LF)(SN)  [S6B-XH-SM4-TB(LF)(SN)]
U$9  S6B-XH-SM4-TB(LF)(SN)  [S6B-XH-SM4-TB(LF)(SN)]
U$10  S6B-XH-SM4-TB(LF)(SN)  [S6B-XH-SM4-TB(LF)(SN)]
U$11  FCN-365P040-BACKPLANE  [FCN-365J040-BACKPLANE-JACK]
U$12  LTC6103  [MSOP8]
U$13  MICROFIT-2CK-HEADER  [MICROFIT-2CKT-HEADER]
U$14  MICROFIT-8CKT-HEADER  [MICROFIT-8CKT-HEADER]
U$15  MICROFIT-10CKT-HEADER  [MICROFIT-10CKT-HEADER]
U$16  FCN-365P040-BACKPLANE  [FCN-365J040-BACKPLANE-JACK]
U$17  S6B-XH-SM4-TB(LF)(SN)  [S6B-XH-SM4-TB(LF)(SN)]
U$18  ADS1115  ADS1115DGST  [SOP50P490X110-10N]
U$19  S6B-XH-SM4-TB(LF)(SN)  [S6B-XH-SM4-TB(LF)(SN)]
U$20  LVK25R002FER(CURRENT-SENSE-R)  [LVK25R002FER(CURRENT-SENSE-R)]
U$21  LVK25R002FER(CURRENT-SENSE-R)  [LVK25R002FER(CURRENT-SENSE-R)]
U$22  100UF  100UF-AFK-CAP  [100UF-AFK-CAP]
U$23  MIC2005A-1YM5  [SOT23-5]
U$24  MIC2005A-1YM5  [SOT23-5]
U$25  MCP2515-I/SO  [SOIC127P1034X264-18N]
U$26  RJ45-DUAL-SOCKET  [RJ45DOUBLESOCKET]
U$27  RJ45-DUAL-SOCKET  [RJ45DOUBLESOCKET]
U$28  MIC2005A-1YM5  [SOT23-5]
U$29  USB-DUAL-SOCKET  [USB-DUAL-SOCKET]
U$30  USB-DUAL-SOCKET  [USB-DUAL-SOCKET]
U$31  MIC2005A-1YM5  [SOT23-5]
U$32  IRLR3636PBF(N-MOS)  [TO252]
U$33  MIC2005A-1YM5  [SOT23-5]
U$34  ISO1050  [DUB-8]
U$35  MINIFIT-4CKT-2ROW-W2B-90DEG  [MINIFIT-4CKT-2ROW-W2B-90DEG]
U$36  MINIFIT-4CKT-2ROW-W2B-90DEG  [MINIFIT-4CKT-2ROW-W2B-90DEG]
U$37  MINIFIT-4CKT-2ROW-W2B-90DEG  [MINIFIT-4CKT-2ROW-W2B-90DEG]
U$38  MINIFIT-4CKT-2ROW-W2B-90DEG  [MINIFIT-4CKT-2ROW-W2B-90DEG]
U$39  MOLEX-MINIFIT-10CKT2ROW-90DEG-HEADER  [MOLEX-MINIFIT-10CKT2ROW-90DEG-HEADER]
U$40  ISO1050  [DUB-8]
U$41  USB-DUAL-SOCKET  [USB-DUAL-SOCKET]
U$44  MIC2005A-1YM5  [SOT23-5]
U$45  MINIFIT-10CKT-STRAIGHTHEADER  [MINIFIT-10CKT-STRAIGHTHEADER]
U$46  MIC2005A-1YM5  [SOT23-5]
U$47  USB-DUAL-SOCKET  [USB-DUAL-SOCKET]
U$48  MIC2005A-1YM5  [SOT23-5]
U$49  MIC2005A-1YM5  [SOT23-5]
U$50  PLATED-HOLE  [PLATED-HOLE]
U$51  MIC2005A-1YM5  [SOT23-5]
U$52  MICROFIT-4CKT-HEADER  [MICROFIT-4CKT-HEADER]
U$53  MIC2005A-1YM5  [SOT23-5]
U$54  MIC2005A-1YM5  [SOT23-5]
U$55  LTC6103  [MSOP8]
U$56  LTC6103  [MSOP8]
U$57  ADS1115  ADS1115DGST  [SOP50P490X110-10N]
U$58  LVK25R002FER(CURRENT-SENSE-R)  [LVK25R002FER(CURRENT-SENSE-R)]
U$59  LVK25R002FER(CURRENT-SENSE-R)  [LVK25R002FER(CURRENT-SENSE-R)]
U$60  LTC6103  [MSOP8]
U$61  MICROFIT-4CKT-HEADER  [MICROFIT-4CKT-HEADER]
U$62  ADS1115DGST  [SOP50P490X110-10N]
U$63  LVK25R002FER(CURRENT-SENSE-R)  [LVK25R002FER(CURRENT-SENSE-R)]
U$64  MICROFIT-4CKT-HEADER  [MICROFIT-4CKT-HEADER]
U$65  MICROFIT-4CKT-HEADER  [MICROFIT-4CKT-HEADER]
U$70  PLATED-HOLE  [PLATED-HOLE]
U$76  N-MOS-SOIC8  [SOIC8]
U$77  N-MOS  N-MOS-SOIC8  [SOIC8]
U$78  N-MOS-SOIC8  [SOIC8]

## Nets
3.3V: U$11.B19 U$39.A5 U$39.B5
5V: 24AA1026.8(VCC) AD7414-1.3(VDD) C20.1 C21.1 C27.1 C28.1 C47.1 C55.1 C56.1 I2C.4 LED5.A MCP2515-I/SO.18(VDD) P-MOS1.1(S) P-MOS1.2(S) P-MOS1.3(S) P-MOS5.1(S) P-MOS5.2(S) P-MOS5.3(S) P-MOS6.1(S) P-MOS6.2(S) P-MOS6.3(S) R17.2 R27.2 R29.2 R43.2 R46.2 R48.1 R72.1 R73.2 R79.2 R103.1 U1.4(VCC) U1.6(VCC) U4.1(VS_2) U4.2(VS) U5.1(VS_2) U5.2(VS) U13.10(VCC_3) U13.31(VCC_2) U13.61(VCC_4) U13.80(VCC) U13.100(AVCC) U$1.P$3 U$5.POS(+) U$10.P$6 U$17.P$6 U$18.8(VDD) U$19.P$6 U$22.POS(+) U$24.1(VIN) U$24.3(EN) U$25.18(VDD) U$34.1(VCC1) U$39.A3 U$39.B3 U$40.1(VCC1) U$54.1(VIN) U$54.3(EN) U$57.8(VDD) U$62.1(ADDR) U$62.8(VDD)
5V_ADC: R17.1 R18.2 U13.93(PF4_(ADC4/TCK))
5V_CAN_BP: C19.2 C54.P$1(+) R44.1 U5.14(VO) U$40.8(VCC2)
5V_UART_CAN: C26.2 C53.P$1(+) R47.1 U4.14(VO) U$34.8(VCC2)
5VSA: P-MOS1.5(D) P-MOS1.6(D) P-MOS1.7(D) P-MOS1.8(D) R68.1 U$16.B19 U$46.1(VIN) U$46.3(EN)
5VTE: P-MOS6.5(D) P-MOS6.6(D) P-MOS6.7(D) P-MOS6.8(D) R66.1 U$11.B20 U$48.1(VIN) U$48.3(EN)
5VTH: P-MOS5.5(D) P-MOS5.6(D) P-MOS5.7(D) P-MOS5.8(D) R67.1 U$33.1(VIN) U$33.3(EN) U$45.L2
12IDSFI1: JP5.1 JP8.1 JP10.3 KILL-SWITCH.2 Q2.2(E)
12V: 12VFAN.1 LED-STRIP1.1 LED-STRIP2.1 R15.2 U$1.P$2 U$13.PIN1 U$39.A2 U$39.B2
12V-TO-M4: U$39.A4 U$39.B4 U$64.BOT1(B1) U$64.TOP1
12V_ADC: R15.1 R16.2 U13.92(PF5_(ADC5/TMS))
24V1: LTC4416.8(VS) P-MOS3.1(S) P-MOS3.2(S) P-MOS3.3(S) P-MOS.1(S) P-MOS.2(S) P-MOS.3(S) R101.2 U$20.I2
24V1_ADC: R101.1 R102.2 U13.94(PF3_(ADC3))
24V2: U$20.I1 U$21.I2 U$52.BOT1(B1) U$52.TOP1 U$61.BOT1(B1) U$61.TOP1
24V2SA: U$14.BOT1(B1) U$14.BOT2(B2) U$14.BOT3(B3) U$14.BOT4(B4) U$15.T5 U$16.B20 U$21.I1
24V-ACOU: U$3.U4 U$3.U5 U$58.I1
24V-NAV: U$27.U4 U$27.U5 U$63.I1
24V-POE: U$1.P$4 U$58.I2 U$59.I2 U$63.I2 U$65.BOT1(B1) U$65.TOP1
24V-SONAR: U$26.U4 U$26.U5 U$59.I1
A+: U$26.L1 U$26.U1
A-: U$26.L2 U$26.U2
ACOU-A+: U$3.L1 U$3.U1
ACOU-A-: U$3.L2 U$3.U2
ACOU-B+: U$3.L3 U$3.U3
ACOU-B-: U$3.L6 U$3.U6
ACOU_EN: U13.51(PG0_(~WR)) U$77.4(G)
ACOU_GND: U$3.U7 U$3.U8 U$77.5(D) U$77.6(D) U$77.7(D) U$77.8(D)
B1: LED-STRIP2.2 U$16.B16
B2: LED-STRIP1.2 U$16.A16
B+: U$26.L3 U$26.U3
B-: U$26.L6 U$26.U6
BATT1: LED1.A LED2.C LTC4416.9(V1) P-MOS4.1(S) P-MOS4.2(S) P-MOS4.3(S) R1.2 R6.2 R11.2 U$4.L5 U$4.L6 U$4.U5 U$4.U6 U$37.LL U$37.LR U$37.UL U$37.UR
BATT1_ADC: R11.1 R12.2 U13.95(PF2_(ADC2))
BATT2: LED3.A LED4.C LTC4416.7(V2) P-MOS2.1(S) P-MOS2.2(S) P-MOS2.3(S) R10.2 R13.2 U$4.L7 U$4.L8 U$4.U7 U$4.U8 U$38.LL U$38.LR U$38.UL U$38.UR
BATT2_ADC: R13.1 R14.2 U13.96(PF1_(ADC1))
CAN_RXD: RXCAN.A U$25.2(RXCAN) U$34.2(RXD)
CAN_RXD_BP: MCP2515-I/SO.2(RXCAN) RX.A U$40.2(RXD)
CAN_TXD_BP: MCP2515-I/SO.1(TXCAN) TX.A U$40.3(TXD)
CANH: R104.2 R105.2 U$10.P$4 U$11.A1 U$16.A1 U$17.P$4 U$19.P$4 U$34.7(CANH) U$40.7(CANH) U$45.L1
CANL: R104.1 R105.1 U$10.P$3 U$11.A2 U$16.A2 U$17.P$3 U$19.P$3 U$34.6(CANL) U$40.6(CANL) U$45.U1
CTS_BP: ADUM1402.11(VID)
CTS_CAN: ADUM1.11(VID)
CTS_CAN_ISO: ADUM1.6(VOD)
CTS_TH_ISO: ADUM2.6(VOD)
D+_BP: U2.15(USBDP) U$30.U3(UDP)
D+_CAN: U6.15(USBDP) U$41.U3(UDP)
D+_PMB1: U9.15(USBDP) U$29.L3(LDP)
D+_PMB2: U11.15(USBDP) U$29.U3(UDP)
D+_SA: U7.15(USBDP) U$47.L3(LDP)
D+_TE: U8.15(USBDP) U$47.U3(UDP)
D+_TH: U3.15(USBDP) U$30.L3(LDP)
D-_BP: U2.16(USBDM) U$30.U2(UDM)
D-_CAN: U6.16(USBDM) U$41.U2(UDM)
D-_PMB1: U9.16(USBDM) U$29.L2(LDM)
D-_PMB2: U11.16(USBDM) U$29.U2(UDM)
D-_SA: U7.16(USBDM) U$47.L2(LDM)
D-_TE: U8.16(USBDM) U$47.U2(UDM)
D-_TH: U3.16(USBDM) U$30.L2(LDM)
DTR_BP: ADUM1402.13(VOB) C44.1
DTR_BP_ISO: ADUM1402.4(VIB) U2.2(DTR)
DTR_CAN: ADUM1.13(VOB) C41.1
DTR_CAN_ISO: ADUM1.4(VIB) U6.2(DTR)
DTR_PMB1_ISO: U9.2(DTR) U$8.P$6
DTR_PMB2_ISO: U11.2(DTR) U$9.P$6
DTR_SA: ADUM3.13(VOB) U$16.B2
DTR_SA_ISO: ADUM3.4(VIB) U7.2(DTR)
DTR_TE: ADUM4.13(VOB) U$11.B2
DTR_TE_ISO: ADUM4.4(VIB) U8.2(DTR)
DTR_TH: ADUM2.13(VOB) U$45.L3
DTR_TH_ISO: ADUM2.4(VIB) U3.2(DTR)
G1: LED-STRIP2.3 U$16.B17
G2: LED-STRIP1.3 U$16.A17
GATE1: LTC4416.10(G1) P-MOS3.4(G) P-MOS4.4(G)
GATE2: LTC4416.6(G2) P-MOS2.4(G) P-MOS.4(G)
GND: 12VFAN.2 24AA1026.2(A1) 24AA1026.3(A2) 24AA1026.4(VSS) 24AA1026.7(WP) AD7414-1.1(AS) AD7414-1.2(GND) ADUM1.9(GND2_2) ADUM1.15(GND2) ADUM2.9(GND2_2) ADUM2.15(GND2) ADUM3.9(GND2_2) ADUM3.15(GND2) ADUM4.9(GND2_2) ADUM4.15(GND2) ADUM1402.9(GND2_2) ADUM1402.15(GND2) C4.2 C6.2 C10.2 C12.2 C15.1 C16.1 C17.1 C18.1 C19.1 C20.2 C21.2 C22.1 C23.1 C25.2 C26.1 C27.2 C28.2 C30.2 C32.2 C36.2 C38.2 C42.1 C43.1 C47.2 C48.1 C55.2 C56.2 C58.2 I2C.1 ISP-BP.6(GND) ISP.6(GND) JP8.3 JP10.1 KILL-SWITCH.1 LTC4416.3(GND) MCP2515-I/SO.9(VSS) R2.1 R12.1 R14.1 R16.1 R18.1 R19.2 R20.2 R23.2 R24.2 R36.2 R42.2 R54.2 R60.2 R61.1 R62.1 R78.2 R81.2 R82.2 R85.2 R86.2 R89.2 R90.2 R93.1 R94.1 R95.1 R102.1 SA.C SW1.P$1 SW1.P$4 SW2.P$1 SW2.P$4 TE.C TH.C U1.3(GND) U1.21(AGND) U4.13(0VOUT) U4.26(0VIN_2) U4.27(0VIN) U5.13(0VOUT) U5.26(0VIN_2) U5.27(0VIN) U13.11(GND_2) U13.32(GND_4) U13.62(GND_3) U13.81(GND_5) U13.99(GND) U$1.P$1 U$2.P$1 U$4.L1 U$4.L2 U$4.L3 U$4.L4 U$4.U1 U$4.U2 U$4.U3 U$4.U4 U$5.NEG(-) U$6.4(V-) U$7.3(D) U$10.P$1 U$11.A19 U$11.A20 U$11.B1 U$12.4(V-) U$14.TOP3 U$14.TOP4 U$16.A19 U$16.A20 U$16.B1 U$17.P$1 U$18.3(GND) U$19.P$1 U$22.NEG(-) U$24.2(GND) U$25.9(VSS) U$32.3(D) U$33.2(GND) U$34.4(GND1) U$34.5(GND2) U$39.A1 U$39.B1 U$40.4(GND1) U$40.5(GND2) U$45.U2 U$46.2(GND) U$48.2(GND) U$52.BOT2(B2) U$52.TOP2 U$54.2(GND) U$55.4(V-) U$56.4(V-) U$57.3(GND) U$60.4(V-) U$61.BOT2(B2) U$61.TOP2 U$62.3(GND) U$64.BOT2(B2) U$64.TOP2 U$65.BOT2(B2) U$65.TOP2 U$70.P$1 U$76.1(S) U$76.2(S) U$76.3(S) U$77.1(S) U$77.2(S) U$77.3(S) U$78.1(S) U$78.2(S) U$78.3(S)
GND_IN: C1.2 C2.2 D1.A D3.A R3.1 R4.1 R5.1 R7.1 R8.1 R9.1 U$7.2(S) U$32.2(S) U$35.LL U$35.LR U$35.UL U$35.UR U$36.LL U$36.LR U$36.UL U$36.UR
INT_BP: MCP2515-I/SO.12(~INT)
INTERRUPT_UART_CAN: U$25.12(~INT)
L1: U$14.TOP1 U$16.B15
L2: U$14.TOP2 U$16.A15
LVE1: ADUM1402.7(VE1) R32.1
LVE2: ADUM2.7(VE1) R38.1
LVE3: ADUM3.7(VE1) R50.1
LVE4: ADUM4.7(VE1) R56.1
LVE7: ADUM1.7(VE1) R74.1
M1: U$15.B5 U$16.B14
M2: U$15.B4 U$16.A14
M3: U$15.T4 U$16.B13
M4: U$15.B3 U$16.A13
M5: U$15.T3 U$16.B12
M6: U$15.B2 U$16.A12
M7: U$15.T2 U$16.B11
M8: U$15.B1 U$16.A11
M9: U$15.T1 U$16.B10
MISO_BP: ISP-BP.1(MISO) MCP2515-I/SO.15(SO) U13.22((MISO/PCINT3)_PB3)
MISO_UART_CAN: ISP.1(MISO) U1.16(PB4(MISO)) U$25.15(SO)
MOSI_BP: ISP-BP.4(MOSI) MCP2515-I/SO.14(SI) U13.21((MOSI/PCINT2)_PB2)
MOSI_UART_CAN: ISP.4(MOSI) U1.15(PB3(MOSI/OC2)) U$25.14(SI)
N$1: P-MOS3.5(D) P-MOS3.6(D) P-MOS3.7(D) P-MOS3.8(D) P-MOS4.5(D) P-MOS4.6(D) P-MOS4.7(D) P-MOS4.8(D)
N$2: P-MOS2.5(D) P-MOS2.6(D) P-MOS2.7(D) P-MOS2.8(D) P-MOS.5(D) P-MOS.6(D) P-MOS.7(D) P-MOS.8(D)
N$3: R33.2 TX-BP.C
N$4: R33.1 U2.23(TXLED)
N$5: R34.2 RX-BP.C
N$6: FERRITE.2 U$23.1(VIN) U$23.3(EN)
N$7: ADUM1402.10(VE2) R31.1
N$8: R35.2 SW_USB_BP.C
N$9: R36.1 SW_5V_BP.A
N$10: R39.2 RX-TH.C
N$11: R34.1 U2.22(RXLED)
N$12: R40.2 TX-TH.C
N$13: ADUM2.10(VE2) R37.1
N$14: FERRITE1.2 U$31.1(VIN) U$31.3(EN)
N$15: R41.2 SW_USB_SA.C
N$16: R39.1 U3.22(RXLED)
N$17: R40.1 U3.23(TXLED)
N$18: R42.1 SW_5V_TH.A
N$19: C22.2 Q3.1 U$25.7(OSC2)
N$20: C23.2 Q3.2 U$25.8(OSC1)
N$21: C15.2 MCP2515-I/SO.7(OSC2) Q4.1
N$22: C16.2 MCP2515-I/SO.8(OSC1) Q4.2
N$23: R46.1 U$25.17(~RESET)
N$24: C42.2 Q7.1 U1.7(PB6(XTAL1/TOSC1))
N$25: MCP2515-I/SO.17(~RESET) R43.1
N$26: U13.8((T3/INT6)_PE6)
N$27: R47.2 U4.17(~ERROR)
N$28: R51.2 TX-SA.C
N$29: R52.2 RX-SA.C
N$30: ADUM3.10(VE2) R49.1
N$31: FERRITE2.2 U$44.1(VIN) U$44.3(EN)
N$32: R53.2 SW_USB_SA1.C
N$33: R51.1 U7.23(TXLED)
N$34: R52.1 U7.22(RXLED)
N$35: LED2.A R3.2
N$36: LED1.C R4.2
N$37: R54.1 SW_5V_SA.A
N$38: R57.2 TX-TE.C
N$39: R58.2 RX-TE.C
N$40: ADUM4.10(VE2) R55.1
N$41: FERRITE3.2 U$28.1(VIN) U$28.3(EN)
N$42: R59.2 SW_USB_TE.C
N$43: R61.2 TXCAN.C
N$44: U13.54(PC1_(A9))
N$45: U$11.A3
N$46: U$11.A4
N$47: U$11.A5
N$48: U$11.A6
N$49: U$11.A7
N$50: U$11.A8
N$51: U$11.A9
N$52: U$11.A10
N$53: U$11.A11
N$54: U$11.A12
N$55: U$11.A13
N$56: U$11.A14
N$57: U$11.A15
N$58: U$11.A16
N$59: U$11.A17
N$60: U$11.A18
N$61: R62.2 RXCAN.C
N$62: R93.2 TX.C
N$63: R63.2 TX-PMB1.C
N$64: R64.2 RX-PMB1.C
N$65: R66.2 TE.A
N$66: FERRITE4.2 U$49.1(VIN) U$49.3(EN)
N$67: U$11.B5
N$68: U$11.B6
N$69: U$11.B7
N$70: U$11.B8
N$71: U$11.B9
N$72: U$11.B10
N$73: U$11.B11
N$74: U$11.B12
N$75: U$11.B13
N$76: U$11.B14
N$77: U$11.B15
N$78: U$11.B16
N$79: U$11.B17
N$80: U$11.B18
N$81: R75.2 RX-CAN.C
N$82: R76.2 TX-CAN.C
N$83: R67.2 TH.A
N$84: R57.1 U8.23(TXLED)
N$85: R58.1 U8.22(RXLED)
N$86: R60.1 SW_5V_TE.A
N$87: JP5.2 P-MOS5.4(G) R29.1
N$88: JP5.3 Q2.3(C)
N$89: JP6.2 P-MOS1.4(G) R27.1
N$90: Q2.1(B) R30.1
N$91: JP6.3 Q1.3(C)
N$92: Q1.1(B) R28.1
N$93: JP6.1 JP8.2 Q1.2(E)
N$94: ADUM1.10(VE2) R45.1
N$95: R65.2 SW_USB_PMB1.C
N$96: R63.1 U9.23(TXLED)
N$97: R64.1 U9.22(RXLED)
N$98: R68.2 SA.A
N$99: R69.2 TX-PMB2.C
N$100: R70.2 RX-PMB2.C
N$101: R44.2 U5.17(~ERROR)
N$102: R75.1 U6.22(RXLED)
N$103: FERRITE5.2 U$51.1(VIN) U$51.3(EN)
N$104: R71.2 SW_USB_PMB2.C
N$105: R69.1 U11.23(TXLED)
N$106: R70.1 U11.22(RXLED)
N$107: R76.1 U6.23(TXLED)
N$108: R94.2 RX.C
N$109: LED5.C R95.2
N$112: AD7414-1.5(ALRT)
N$113: U13.55(PC2_(A10))
N$114: U13.56(PC3_(A11))
N$115: LTC4416.2(E1) R1.1
N$116: LTC4416.4(!E2) R2.2
N$117: C48.2 U13.98(AREF)
N$118: C43.2 Q7.2 U1.8(PB7(XTAL2/TOSC2))
N$119: U13.57(PC4_(A12))
N$120: U13.58(PC5_(A13))
N$121: C17.2 Q5.1 U13.33(XTAL2)
N$122: C18.2 Q5.2 U13.34(XTAL1)
N$123: U13.25((OC1B/PCINT6)_PB6)
N$124: U13.26((OC0A/OC1C/PCINT7)_PB7)
N$125: U1.18(AVCC)
N$126: U13.59(PC6_(A14))
N$128: U13.72(PA6_(AD6))
N$129: U13.71(PA7_(AD7))
N$130: ISP-BP.2(VCC)
N$131: ISP.2(VCC)
N$132: FERRITE6.2 U$53.1(VIN) U$53.3(EN)
N$133: R77.2 SW_USB_CAN.C
N$134: U13.60(PC7_(A15))
N$136: R78.1 SW_5V_CAN.A
N$138: Q6.1(B) R80.1
N$139: JP9.3 Q6.3(C)
N$140: JP9.2 P-MOS6.4(G) R79.1
N$141: JP9.1 JP10.2 Q6.2(E)
N$142: R83.1 U$55.5(+INB) U$58.V1
N$143: R84.1 U$55.8(+INA) U$58.V2
N$144: R81.1 U$55.1(OUTA) U$57.4(AIN0)
N$145: R82.1 U$55.2(OUTB) U$57.5(AIN1)
N$146: U$55.3(NC)
N$147: R83.2 U$55.7(-INA)
N$148: R84.2 U$55.6(-INB)
N$149: R87.1 U$56.5(+INB) U$59.V1
N$150: R88.1 U$56.8(+INA) U$59.V2
N$151: R85.1 U$56.1(OUTA) U$57.7(AIN3)
N$152: R86.1 U$56.2(OUTB) U$57.6(AIN2)
N$153: U$56.3(NC)
N$154: R87.2 U$56.7(-INA)
N$155: R88.2 U$56.6(-INB)
N$156: U$57.2(ALRT)
N$158: R91.1 U$60.5(+INB) U$63.V1
N$159: R92.1 U$60.8(+INA) U$63.V2
N$160: R89.1 U$60.1(OUTA) U$62.4(AIN0)
N$161: R90.1 U$60.2(OUTB) U$62.5(AIN1)
N$162: U$60.3(NC)
N$163: R91.2 U$60.7(-INA)
N$164: R92.2 U$60.6(-INB)
N$172: U$62.2(ALRT)
N$173: U13.45((RXD1/INT2)_PD2)
N$182: U13.46((TXD1/INT3)_PD3)
N$183: U13.47((ICP1)_PD4)
N$184: U13.48((XCK1)_PD5)
N$188: U13.4((XCK0/AIN0)_PE2)
N$189: U13.5((OC3A/AIN1)_PE3)
N$190: U13.6((OC3B/INT4)_PE4)
N$191: U13.7((OC3C/INT5)_PE5)
N$193: U13.9((CLKO/ICP3/INT7)_PE7)
N$205: U13.91(PF6_(ADC6/TDO))
N$206: U13.90(PF7_(ADC7/TDI))
N$207: C1.1 D2.A R5.2 R6.1 U$32.1(G)
N$208: LED4.A R7.2
N$209: D1.C D2.C
N$210: LED3.C R8.2
N$211: C2.1 D4.A R9.2 R10.1 U$7.1(G)
N$212: D3.C D4.C
N$215: U13.12((RXD2)_PH0)
N$216: U13.13((TXD2)_PH1)
N$217: U13.14((XCK2)_PH2)
N$218: U13.15((OC4A)_PH3)
N$219: U13.16((OC4B)_PH4)
N$221: U13.18((OC2B)_PH6)
N$222: U13.27((T4)_PH7)
N$223: U13.63(PJ0_(RXD3/PCINT9))
N$224: U13.64(PJ1_(TXD3/PCINT10))
N$225: U13.65(PJ2_(XCK3/PCINT11))
N$226: U13.66(PJ3_(PCINT12))
N$227: U13.23((OC2A/PCINT4)_PB4)
N$228: U13.24((OC1A/PCINT5)_PB5)
N$229: U13.67(PJ4_(PCINT13))
N$230: U13.68(PJ5_(PCINT14))
N$231: U13.69(PJ6_(PCINT15))
N$232: U13.79(PJ7)
N$233: U13.89(PK0_(ADC8/PCINT16))
N$234: U13.88(PK1_(ADC9/PCINT17))
N$235: U13.87(PK2_(ADC10/PCINT18))
N$236: U13.86(PK3_(ADC11/PCINT19))
N$237: U13.85(PK4_(ADC12/PCINT20))
N$238: U13.84(PK5_(ADC13/PCINT21))
N$239: U13.83(PK6_(ADC14/PCINT22))
N$240: U13.82(PK7_(ADC15/PCINT23))
N$241: U13.35((ICP4)_PL0)
N$242: U13.36((ICP5)_PL1)
N$243: U13.37((T5)_PL2)
N$244: U13.38((OC5A)_PL3)
N$245: U13.39((OC5B)_PL4)
N$246: U13.40(OC5C)_PL5)
N$247: U13.41(PL6)
N$248: U13.42(PL7)
N$251: U13.70(PG2_(ALE))
N$252: U13.28((TOSC2)_PG3)
N$253: U13.29((TOSC1)_PG4)
N$254: U13.1((OC0B)_PG5)
N$263: R21.1 U$6.5(+INB) U$20.V1
N$267: R22.1 U$6.8(+INA) U$20.V2
N$276: R19.1 U$6.1(OUTA) U$18.7(AIN3)
N$279: R20.1 U$6.2(OUTB) U$18.6(AIN2)
N$280: U$6.3(NC)
N$282: R21.2 U$6.7(-INA)
N$284: R22.2 U$6.6(-INB)
N$285: R25.1 U$12.5(+INB) U$21.V1
N$287: R26.1 U$12.8(+INA) U$21.V2
N$289: R23.1 U$12.1(OUTA) U$18.4(AIN0)
N$290: R24.1 U$12.2(OUTB) U$18.5(AIN1)
N$291: U$12.3(NC)
N$292: R25.2 U$12.7(-INA)
N$293: R26.2 U$12.6(-INB)
N$294: U$18.2(ALRT)
NAV-A+: U$27.L1 U$27.U1
NAV-A-: U$27.L2 U$27.U2
NAV-B+: U$27.L3 U$27.U3
NAV-B-: U$27.L6 U$27.U6
NAV_EN: U13.53(PC0_(A8)) U$76.4(G)
NAV_GND: U$27.U7 U$27.U8 U$76.5(D) U$76.6(D) U$76.7(D) U$76.8(D)
PRES: U$13.PIN2 U$16.A10
R1: LED-STRIP2.4 U$16.B18
R2: LED-STRIP1.4 U$16.A18
RESET_BP: C44.2 ISP-BP.5(RST) R103.2 SW2.P$2 SW2.P$3 U13.30(~RESET)
RESET_UART_CAN: C41.2 ISP.5(RST) R72.2 SW1.P$2 SW1.P$3 U1.29(PC6(/RESET))
RX_BP: ADUM1402.14(VOA) U13.2((RXD0/PCINT8)_PE0)
RX_BP_ISO: ADUM1402.3(VIA) U2.1(TXD)
RX_CAN: ADUM1.14(VOA) TXCAN.A U1.30(PD0(RXD)) U$25.1(TXCAN) U$34.3(TXD)
RX_CAN_ISO: ADUM1.3(VIA) U6.1(TXD)
RX_PMB1_ISO: U9.1(TXD) U$8.P$4
RX_PMB2_ISO: U11.1(TXD) U$9.P$4
RX_SA: ADUM3.14(VOA) U$16.B3
RX_SA_1: SPARE2.2 U$16.A3
RX_SA_ISO: ADUM3.3(VIA) U7.1(TXD)
RX_TE: ADUM4.14(VOA) U$11.B3
RX_TE_ISO: ADUM4.3(VIA) U8.1(TXD)
RX_TH: ADUM2.14(VOA) U$45.U4
RX_TH_ISO: ADUM2.3(VIA) U3.1(TXD)
SA_EN: R28.2 U13.50((T0)_PD7)
SCK_BP: ISP-BP.3(SCK) MCP2515-I/SO.13(SCK) U13.20((SCK/PCINT1)_PB1)
SCK_UART_CAN: ISP.3(SCK) U1.17(PB5(SCK)) U$25.13(SCK)
SCL: 24AA1026.6(SCL) AD7414-1.4(SCL) I2C.2 U13.43((SCL/INT0)_PD0) U$18.1(ADDR) U$18.10(SCL) U$57.10(SCL) U$62.10(SCL)
SDA: 24AA1026.5(SDA) AD7414-1.6(SDA) I2C.3 U13.44((SDA/INT1)_PD1) U$18.9(SDA) U$57.1(ADDR) U$57.9(SDA) U$62.9(SDA)
SONAR_EN: U13.52(PG1_(~RD)) U$78.4(G)
SONAR_GND: U$26.U7 U$26.U8 U$78.5(D) U$78.6(D) U$78.7(D) U$78.8(D)
SPARE1: SPARE.2 U$16.B9
SPARE2: SPARE.4 U$16.B8
SPARE3: SPARE.6 U$16.B7
SPARE4: SPARE.8 U$16.B6
SPARE5: SPARE.10 U$16.B5
SPARE6: SPARE.1 U$16.A9
SPARE7: SPARE.3 U$16.A8
SPARE8: SPARE.5 U$16.A7
SPARE9: SPARE.7 U$16.A6
SPARE10: SPARE.9 U$16.A5
SPARE_TH_1: U$45.U3
SPARE_TH_2: U$45.U5
SPARE_TH_3: U$45.L5
SS_BP: MCP2515-I/SO.16(~CS) R73.1 U13.17((OC4C)_PH5)
SS_UART_CAN: R48.2 U1.12(PB0(ICP)) U$25.16(~CS)
SW_5V_BP: ADUM1402.16(VDD2) C4.1 C6.1 R31.2 SW_5V_BP.C U$24.5(VOUT)
SW_5V_CAN: ADUM1.16(VDD2) C25.1 C58.1 R45.2 SW_5V_CAN.C U$54.5(VOUT)
SW_5V_SA: ADUM3.16(VDD2) C30.1 C32.1 R49.2 SW_5V_SA.C U$46.5(VOUT)
SW_5V_TE: ADUM4.16(VDD2) C36.1 C38.1 R55.2 SW_5V_TE.C U$48.5(VOUT)
SW_5V_TH: ADUM2.16(VDD2) C10.1 C12.1 R37.2 SW_5V_TH.C U$33.5(VOUT)
SW_USB+_BP: ADUM1402.1(VDD1) C3.1 C5.1 C7.1 C8.1 R32.2 R35.1 RX-BP.A TX-BP.A U2.4(VCCIO) U2.20(VCC) U$23.5(VOUT)
SW_USB+_CAN: ADUM1.1(VDD1) C24.1 C57.1 C59.1 C60.1 R74.2 R77.1 RX-CAN.A TX-CAN.A U6.4(VCCIO) U6.20(VCC) U$53.5(VOUT)
SW_USB+_PMB1: C45.1 C46.1 R65.1 RX-PMB1.A TX-PMB1.A U9.4(VCCIO) U9.20(VCC) U$8.P$3 U$49.5(VOUT)
SW_USB+_PMB2: C51.1 C52.1 R71.1 RX-PMB2.A TX-PMB2.A U11.4(VCCIO) U11.20(VCC) U$9.P$3 U$51.5(VOUT)
SW_USB+_SA: ADUM3.1(VDD1) C29.1 C31.1 C33.1 C34.1 R50.2 R53.1 RX-SA.A TX-SA.A U7.4(VCCIO) U7.20(VCC) U$44.5(VOUT)
SW_USB+_TE: ADUM4.1(VDD1) C35.1 C37.1 C39.1 C40.1 R56.2 R59.1 RX-TE.A TX-TE.A U8.4(VCCIO) U8.20(VCC) U$28.5(VOUT)
SW_USB+_TH: ADUM2.1(VDD1) C9.1 C11.1 C13.1 C14.1 R38.2 R41.1 RX-TH.A TX-TH.A U3.4(VCCIO) U3.20(VCC) U$31.5(VOUT)
TE_EN: R80.2 U13.49((T1)_PD6)
TH_EN: R30.2 U13.97(PF0_(ADC0))
TX_BP: ADUM1402.12(VIC) U13.3((TXD0)_PE1)
TX_BP_ISO: ADUM1402.5(VOC) U2.5(RXD)
TX_CAN: ADUM1.12(VIC) U1.31(PD1(TXD))
TX_CAN_ISO: ADUM1.5(VOC) U6.5(RXD)
TX_PMB1_ISO: U9.5(RXD) U$8.P$5
TX_PMB2_ISO: U11.5(RXD) U$9.P$5
TX_SA: ADUM3.12(VIC) U$16.B4
TX_SA_1: SPARE2.1 U$16.A4
TX_SA_ISO: ADUM3.5(VOC) U7.5(RXD)
TX_TE: ADUM4.12(VIC) U$11.B4
TX_TE_ISO: ADUM4.5(VOC) U8.5(RXD)
TX_TH: ADUM2.12(VIC) U$45.L4
TX_TH_ISO: ADUM2.5(VOC) U3.5(RXD)
USB+_BP: FERRITE.1 U$30.U1(UVCC)
USB+_CAN: FERRITE6.1 U$41.U1(UVCC)
USB+_PMB1: FERRITE4.1 U$29.L1(LVCC)
USB+_PMB2: FERRITE5.1 U$29.U1(UVCC)
USB+_SA: FERRITE2.1 U$47.L1(LVCC)
USB+_TE: FERRITE3.1 U$47.U1(UVCC)
USB+_TH: FERRITE1.1 U$30.L1(LVCC)
USB-_BP: ADUM1402.2(GND1_2) ADUM1402.8(GND1) C3.2 C5.2 C7.2 C8.2 SW_USB_BP.A U2.7(GND7) U2.18(GND18) U2.21(GND21) U2.25(AGND) U2.26(TEST) U$23.2(GND) U$30.CHA3 U$30.CHA4 U$30.U4(UGND)
USB-_CAN: ADUM1.2(GND1_2) ADUM1.8(GND1) C24.2 C57.2 C59.2 C60.2 SW_USB_CAN.A U6.7(GND7) U6.18(GND18) U6.21(GND21) U6.25(AGND) U6.26(TEST) U$41.CHA1 U$41.CHA2 U$41.CHA3 U$41.CHA4 U$41.U4(UGND) U$53.2(GND)
USB-_PMB1: C45.2 C46.2 SW_USB_PMB1.A U9.7(GND7) U9.18(GND18) U9.21(GND21) U9.25(AGND) U9.26(TEST) U$8.P$1 U$29.CHA1 U$29.CHA2 U$29.L4(LGND) U$49.2(GND)
USB-_PMB2: C51.2 C52.2 SW_USB_PMB2.A U11.7(GND7) U11.18(GND18) U11.21(GND21) U11.25(AGND) U11.26(TEST) U$9.P$1 U$29.CHA3 U$29.CHA4 U$29.U4(UGND) U$51.2(GND)
USB-_SA: ADUM3.2(GND1_2) ADUM3.8(GND1) C29.2 C31.2 C33.2 C34.2 SW_USB_SA1.A U7.7(GND7) U7.18(GND18) U7.21(GND21) U7.25(AGND) U7.26(TEST) U$44.2(GND) U$47.CHA1 U$47.CHA2 U$47.L4(LGND)
USB-_TE: ADUM4.2(GND1_2) ADUM4.8(GND1) C35.2 C37.2 C39.2 C40.2 SW_USB_TE.A U8.7(GND7) U8.18(GND18) U8.21(GND21) U8.25(AGND) U8.26(TEST) U$28.2(GND) U$47.CHA3 U$47.CHA4 U$47.U4(UGND)
USB-_TH: ADUM2.2(GND1_2) ADUM2.8(GND1) C9.2 C11.2 C13.2 C14.2 SW_USB_SA.A U3.7(GND7) U3.18(GND18) U3.21(GND21) U3.25(AGND) U3.26(TEST) U$30.CHA1 U$30.CHA2 U$30.L4(LGND) U$31.2(GND)
VREC: C54.P$2(-) U5.12(VREC) U5.16(EN)
VREC2: C53.P$2(-) U4.12(VREC) U4.16(EN)
Unconnected: 24AA1026.1(NC) ADUM2.11(VID) ADUM3.6(VOD) ADUM3.11(VID) ADUM4.6(VOD) ADUM4.11(VID) ADUM1402.6(VOD) LTC4416.1(H1) LTC4416.5(!H2) MCP2515-I/SO.3(CLKOUT/SOF) MCP2515-I/SO.4(~TX0RTS) MCP2515-I/SO.5(~TX1RTS) MCP2515-I/SO.6(~TX2RTS) MCP2515-I/SO.10(~RX1BF) MCP2515-I/SO.11(~RX0BF) U1.1(PD3(INT1)) U1.2(PD4(XCK/T0)) U1.5(GND) U1.9(PD5(T1)) U1.10(PD6(AIN0)) U1.11(PD7(AIN1)) U1.13(PB1(OC1A)) U1.14(PB2(SS/OC1B)) U1.19(ADC6) U1.20(AREF) U1.22(ADC7) U1.23(PC0(ADC0)) U1.24(PC1(ADC1)) U1.25(PC2(ADC2)) U1.26(PC3(ADC3)) U1.27(PC4(ADC4/SDA)) U1.28(PC5(ADC5/SCL)) U1.32(PD2(INT0)) U2.3(RTS) U2.6(RI) U2.9(DSR) U2.10(DCD) U2.11(CTS) U2.12(SLEEP) U2.13(TXDEN) U2.14(PWREN) U2.17(3V3OUT) U2.19(RESET) U2.27(OSCI) U2.28(OSCO) U3.3(RTS) U3.6(RI) U3.9(DSR) U3.10(DCD) U3.11(CTS) U3.12(SLEEP) U3.13(TXDEN) U3.14(PWREN) U3.17(3V3OUT) U3.19(RESET) U3.27(OSCI) U3.28(OSCO) U4.3(NC) U4.15(DNC) U4.28(SYNC) U5.3(NC) U5.15(DNC) U5.28(SYNC) U6.3(RTS) U6.6(RI) U6.9(DSR) U6.10(DCD) U6.11(CTS) U6.12(SLEEP) U6.13(TXDEN) U6.14(PWREN) U6.17(3V3OUT) U6.19(RESET) U6.27(OSCI) U6.28(OSCO) U7.3(RTS) U7.6(RI) U7.9(DSR) U7.10(DCD) U7.11(CTS) U7.12(SLEEP) U7.13(TXDEN) U7.14(PWREN) U7.17(3V3OUT) U7.19(RESET) U7.27(OSCI) U7.28(OSCO) U8.3(RTS) U8.6(RI) U8.9(DSR) U8.10(DCD) U8.11(CTS) U8.12(SLEEP) U8.13(TXDEN) U8.14(PWREN) U8.17(3V3OUT) U8.19(RESET) U8.27(OSCI) U8.28(OSCO) U9.3(RTS) U9.6(RI) U9.9(DSR) U9.10(DCD) U9.11(CTS) U9.12(SLEEP) U9.13(TXDEN) U9.14(PWREN) U9.17(3V3OUT) U9.19(RESET) U9.27(OSCI) U9.28(OSCO) U11.3(RTS) U11.6(RI) U11.9(DSR) U11.10(DCD) U11.11(CTS) U11.12(SLEEP) U11.13(TXDEN) U11.14(PWREN) U11.17(3V3OUT) U11.19(RESET) U11.27(OSCI) U11.28(OSCO) U13.19((~SS/PCINT0)_PB0) U13.73(PA5_(AD5)) U13.74(PA4_(AD4)) U13.75(PA3_(AD3)) U13.76(PA2_(AD2)) U13.77(PA1_(AD1)) U13.78(PA0_(AD0)) U$3.CHA5 U$3.CHA6 U$3.L4 U$3.L5 U$3.L7 U$3.L8 U$8.P$2 U$9.P$2 U$10.P$2 U$10.P$5 U$17.P$2 U$17.P$5 U$19.P$2 U$19.P$5 U$23.4(FAULT) U$24.4(FAULT) U$25.3(CLKOUT/SOF) U$25.4(~TX0RTS) U$25.5(~TX1RTS) U$25.6(~TX2RTS) U$25.10(~RX1BF) U$25.11(~RX0BF) U$26.CHA5 U$26.CHA6 U$26.L4 U$26.L5 U$26.L7 U$26.L8 U$27.CHA5 U$27.CHA6 U$27.L4 U$27.L5 U$27.L7 U$27.L8 U$28.4(FAULT) U$31.4(FAULT) U$33.4(FAULT) U$41.L1(LVCC) U$41.L2(LDM) U$41.L3(LDP) U$41.L4(LGND) U$44.4(FAULT) U$46.4(FAULT) U$48.4(FAULT) U$49.4(FAULT) U$50.P$1 U$51.4(FAULT) U$53.4(FAULT) U$54.4(FAULT) U$62.6(AIN2) U$62.7(AIN3)

## Notes on the sheet
- Temperature sensor
- to kill switch | EEPROM
- Daughter boards power control
- Isolated USB-UART converters
- POWER CONN
- backplane MCU
- Power connectors
- BACKPLANE MCU
- 12V fan power
- Soft-start | USB-UART converters
- SOFT START
- ISOLATED USB-UART CONVERTER | USB-UART CONVERTER
- Load balancer
- S&A board
- telemetry board
- CAN connectors
- thruster board
- LOAD BALANCER
- CAN CONNECTORS
- to acoustic | to sonar | to nav housing
- Voltage measurements
- CAN-USB converter
- to ethernet switch | to ethernet switch | to ethernet switch
- VOLTAGE MEASUREMENT
- Power over Ethernet injectors
- CAN-USB CONVERTER
- POE
- Current measurements
- CURRENT MEASUREMENT
- POEs power control

## Library data of the parts
12VFAN KILL-SWITCH = jumper:JP1E: JUMPER
24AA1026 = backplaneBBAUVv3:24AA1026-I/SM: Serial EEPROM,SOIC-8; MPN: 24AA1026-I/SM; OC_FARNELL: 1971893; OC_NEWARK: 59T0229; PACKAGE: SOIC-8; SUPPLIER: MICROCHIP
AD7414-1 = bbauv:AD7414: ±0.5°C Accurate, 10-Bit Digital Temperature Sensors in SOT-23 The AD7414/AD7415 are complete temperature monitoring systems in 6-lead and 5-lead SOT-23 packages. They contain a band gap temperature sensor and a 10-bit ADC to monitor and digitize the temperature reading to a resolution of 0.25°C.
ADUM1-ADUM4 ADUM1402 = backplaneBBAUVv3:ADUM1402ARWZ: Quad-Channel Digital Isolators; MPN: ADUM1402ARWZ; OC_FARNELL: 1226223; OC_NEWARK: 19M0759; PACKAGE: SOIC-16; SUPPLIER: Analog Devices
C1-C19 C22-C26 C29-C48 C51 C52 C57-C60 = SparkFun-Capacitors:CAP: Capacitor Standard 0603 ceramic capacitor, and 0.1" leaded capacitor.
C20 C21 C27 C28 = SparkFun-Capacitors:1UF-25V-10%(0805): CAP-08064; OC_NEWARK: unknown; PROD_ID: CAP-08064; VALUE: 1uF
C53 C54 = SparkFun-Passives:CAP_POL: Capacitor Polarized These are standard SMD and PTH capacitors. Normally 10uF, 47uF, and 100uF in electrolytic and tantalum varieties. Always verify the external diameter of the through hole cap, it varies with capacity, voltage, and manufacturer. The EIA devices should be standard.
C55 C56 = SparkFun-Passives:CAP: Capacitor Standard 0603 ceramic capacitor, and 0.1" leaded capacitor.
D1-D4 = adafruit:DIODE: Diode SMADIODE - SMA Surface Mount Package 20V 1A Schottky Diode Digikey: 641-1014-6-ND DO-1N4148 - Through Hole Small Current Diode SOD-123 20V 1 A (.5mV Vf) Schottky Diode - Digikey: MBRX120TPMSCT-ND SOD-323 10V 570mA (.38mV Vf, 3ns) Schottky Diode - Digikey: ZLLS410CT-ND SOD-523 30V 30mA Schottky Diode (RB751S-40TE61) - Digikey: RB751S-40TE61CT-ND SOT23-R/W - SOT23 Package (R = Solder Paste/Reflow Ovens, W = Hand-Soldering) BAT54Film 40V 300mA - Digikey: 497-7162-1-ND
FERRITE FERRITE1-FERRITE6 = backplaneBBAUVv3:FERRITE-74279201
I2C = con-lstb:MA04-1: PIN HEADER; OC_FARNELL: unknown; OC_NEWARK: unknown
ISP ISP-BP = adafruit:AVRISP: AVR ISP HEADER Standard 6 pin header for AVR programming
JP5 JP6 JP8-JP10 = jumper:JP2E: JUMPER
LED1-LED5 = adafruit:LED: LED
LED-STRIP1 LED-STRIP2 = SparkFun-Connectors:M04: Header 4 Standard 4-pin 0.1" header. Use with straight break away headers (SKU : PRT-00116), right angle break away headers (PRT-00553), swiss pins (PRT-00743), machine pins (PRT-00117), and female headers (PRT-00115). Molex polarized connector foot print use with SKU : PRT-08231 with associated crimp pins and housings. 1MM SMD Version SKU: PRT-10208
LTC4416 = backplaneBBAUVv3:LTC4416
MCP2515-I/SO U$25 = backplaneBBAUVv3:MCP2515-I/SO: CAN Controller; MPN: MCP2515-I/SO; OC_FARNELL: 1292239; OC_NEWARK: 29H7136; PACKAGE: SOIC-18; SUPPLIER: Microchip
P-MOS P-MOS1-P-MOS6 = backplaneBBAUVv3:P-MOS
Q1 Q2 Q6 = SparkFun-DiscreteSemi:TRANSISTOR_NPN: Generic NPN BJT MMBT2222A - TRANS-08049 (SOT-23, 1A 40V) MPSA42 - TRANS-09116 (SOT-23, 500mA 300V) MMBT5088LT1G - TRANS-11160 (SOT-23, 50 mA 30V) BC547 - COM-08928 <http://www.sparkfun.com/products/8928> (TO-92 45V 100mA) (1.Collector 2.Base 3.Emitter) 2N3904 - COM-00521 <http://www.sparkfun.com/products/521> (TO-92 40V 200mA) (1.Emitter 2.Base 3.Collector) P2N2222A - COM-12852 <http://www.sparkfun.com/products/12852> (TO-92 40V 600mA) (1.Collector 2.Base 3.Emitter); PROD_ID: TRANS-08049
Q3-Q5 Q7 = adafruit:CRYSTAL: CRYSTAL; OC_FARNELL: unknown; OC_NEWARK: unknown
R1 R2 R19-R26 R81-R92 = resistor:R-EU_: RESISTOR, European symbol
R3-R18 R27-R30 R43 R44 R46-R48 R73 R79 R80 R95 R101 R102 R104 R105 = SparkFun-Resistors:RESISTOR: Resistor Basic schematic elements and footprints for 0603, 1206, and PTH resistors.
R31-R42 R45 R49-R72 R74-R78 R93 R94 R103 = SparkFun-Passives:RESISTOR: Resistor Basic schematic elements and footprints for 0603, 1206, and PTH resistors.
RX RX-BP RX-CAN RX-PMB1 RX-PMB2 RX-SA RX-TE RX-TH RXCAN SA SW_5V_BP SW_5V_CAN SW_5V_SA SW_5V_TE SW_5V_TH SW_USB_BP SW_USB_CAN SW_USB_PMB1 SW_USB_PMB2 SW_USB_SA SW_USB_SA1 SW_USB_TE TE TH TX TX-BP TX-CAN TX-PMB1 TX-PMB2 TX-SA TX-TE TX-TH TXCAN = led:LED: LED
SPARE = pinhead:PINHD-2X5: PIN HEADER
SPARE2 = pinhead:PINHD-1X2: PIN HEADER
SW1 SW2 = ver4:MC32829
U1 = SparkFun-DigitalIC:ATMEGA328P_TQFP; PROD_ID: IC-09069
U2 U3 U6-U9 U11 = SparkFun-DigitalIC:FT232RL: USB UART FT232RL 4th Generation USB UART (USB <-> Serial) Controller. Spark Fun Electronics SKU : COM-00650 Production SKU IC-00870; PROD_ID: IC-00870
U4 U5 = backplaneBBAUVv3:DCR010505U: REGULATED DC/DC CONVERTERS; MPN: DCR010505U; OC_FARNELL: 1212384; OC_NEWARK: 84K1268; PACKAGE: SSOP-12; SUPPLIER: TEXAS INSTRUMENTS
U13 = backplaneBBAUVv3:ATMEGA2560-16AU: Microcontroller; DESCRIPTION: Microcontroller; MPN: ATMEGA2560-16AU; OC_FARNELL: 1288330; OC_NEWARK: 23M5051; PACKAGE: LQFP-100; SUPPLIER: ATMEL
U$1 = backplaneBBAUVv3:TERM-BLOCK-4POS
U$2 U$50 U$70 = backplaneBBAUVv3:PLATED-HOLE
U$3 U$26 U$27 = backplaneBBAUVv3:RJ45-DUAL-SOCKET
U$4 = backplaneBBAUVv3:MINIFIT-16CKT-STRAIGHTHEADER
U$5 U$22 = backplaneBBAUVv3:100UF-AFK-CAP
U$6 U$12 U$55 U$56 U$60 = backplaneBBAUVv3:LTC6103
U$7 U$32 = backplaneBBAUVv3:IRLR3636PBF(N-MOS)
U$8-U$10 U$17 U$19 = backplaneBBAUVv3:S6B-XH-SM4-TB(LF)(SN)
U$11 U$16 = FCN-365J040-BACKPLANE-JACK:FCN-365P040-BACKPLANE
U$13 = backplaneBBAUVv3:MICROFIT-2CK-HEADER
U$14 = backplaneBBAUVv3:MICROFIT-8CKT-HEADER
U$15 = backplaneBBAUVv3:MICROFIT-10CKT-HEADER
U$18 U$57 U$62 = bbauv:ADS1115: The ADS1113, ADS1114, and ADS1115 are precision analog-to-digital converters (ADCs) with 16 bits of resolution offered in an ultra-small, leadless QFN-10 package or an MSOP-10 package. The ADS1113/4/5 are designed with precision, power, and ease of implementation in mind. The ADS1113/4/5 feature an onboard reference and oscillator. Data are transferred via an I2C-compatible serial interface; four I2C slave addresses can be selected. The ADS1113/4/5 operate from a single power supply ranging from 2.0V to 5.5V. The ADS1113/4/5 can perform conversions at rates up to 860 samples per second (SPS). An onboard PGA is available on the ADS1114 and ADS1115 that offers input ranges from the supply to as low as ±256mV, allowing both large and small signals to be measured with high resolution. The ADS1115 also features an input multiplexer (MUX) that provides two differential or four single-ended inputs. The ADS1113/4/5 operate either in continuous conversion mode or a single-shot mode that automatically powers down after a conversion and greatly reduces current consumption during idle periods. The ADS1113/4/5 are specified from –40°C to +125°C.
U$20 U$21 U$58 U$59 U$63 = backplaneBBAUVv3:LVK25R002FER(CURRENT-SENSE-R)
U$23 U$24 U$28 U$31 U$33 U$44 U$46 U$48 U$49 U$51 U$53 U$54 = backplaneBBAUVv3:MIC2005A-1YM5
U$29 U$30 U$41 U$47 = backplaneBBAUVv3:USB-DUAL-SOCKET
U$34 U$40 = bbauv:ISO1050: The ISO1050 is a galvanically isolated CAN transceiver that meets the specifications of the ISO11898-2 standard. The device has the logic input and output buffers separated by a silicon oxide (SiO2) insulation barrier that provides galvanic isolation of up to 5000 VRMS for ISO1050DW and 2500 VRMS for ISO1050DUB. Used in conjunction with isolated power supplies, the device prevents noise currents on a data bus or other circuits from entering the local ground and interfering with or damaging sensitive circuitry. As a CAN transceiver, the device provides differential transmit capability to the bus and differential receive capability to a CAN controller at signaling rates up to 1 megabit per second (Mbps). Designed for operation in especially harsh environments, the device features cross-wire, overvoltage and loss of ground protection from –27 V to 40 V and over-temperature shut-down, as well as –12 V to 12 V common-mode range. The ISO1050 is characterized for operation over the ambient temperature range of –55°C to 105°C.
U$35-U$38 = backplaneBBAUVv3:MINIFIT-4CKT-2ROW-W2B-90DEG
U$39 = molex-minifit-10ckt2row-w2b-90degheader:MOLEX-MINIFIT-10CKT2ROW-90DEG-HEADER
U$45 = backplaneBBAUVv3:MINIFIT-10CKT-STRAIGHTHEADER
U$52 U$61 U$64 U$65 = microfit-4ckt-2row-header:MICROFIT-4CKT-HEADER
U$76-U$78 = backplaneBBAUVv3:N-MOS-SOIC8